# Altium project ZYNQ7010_AD9363.PrjPcb
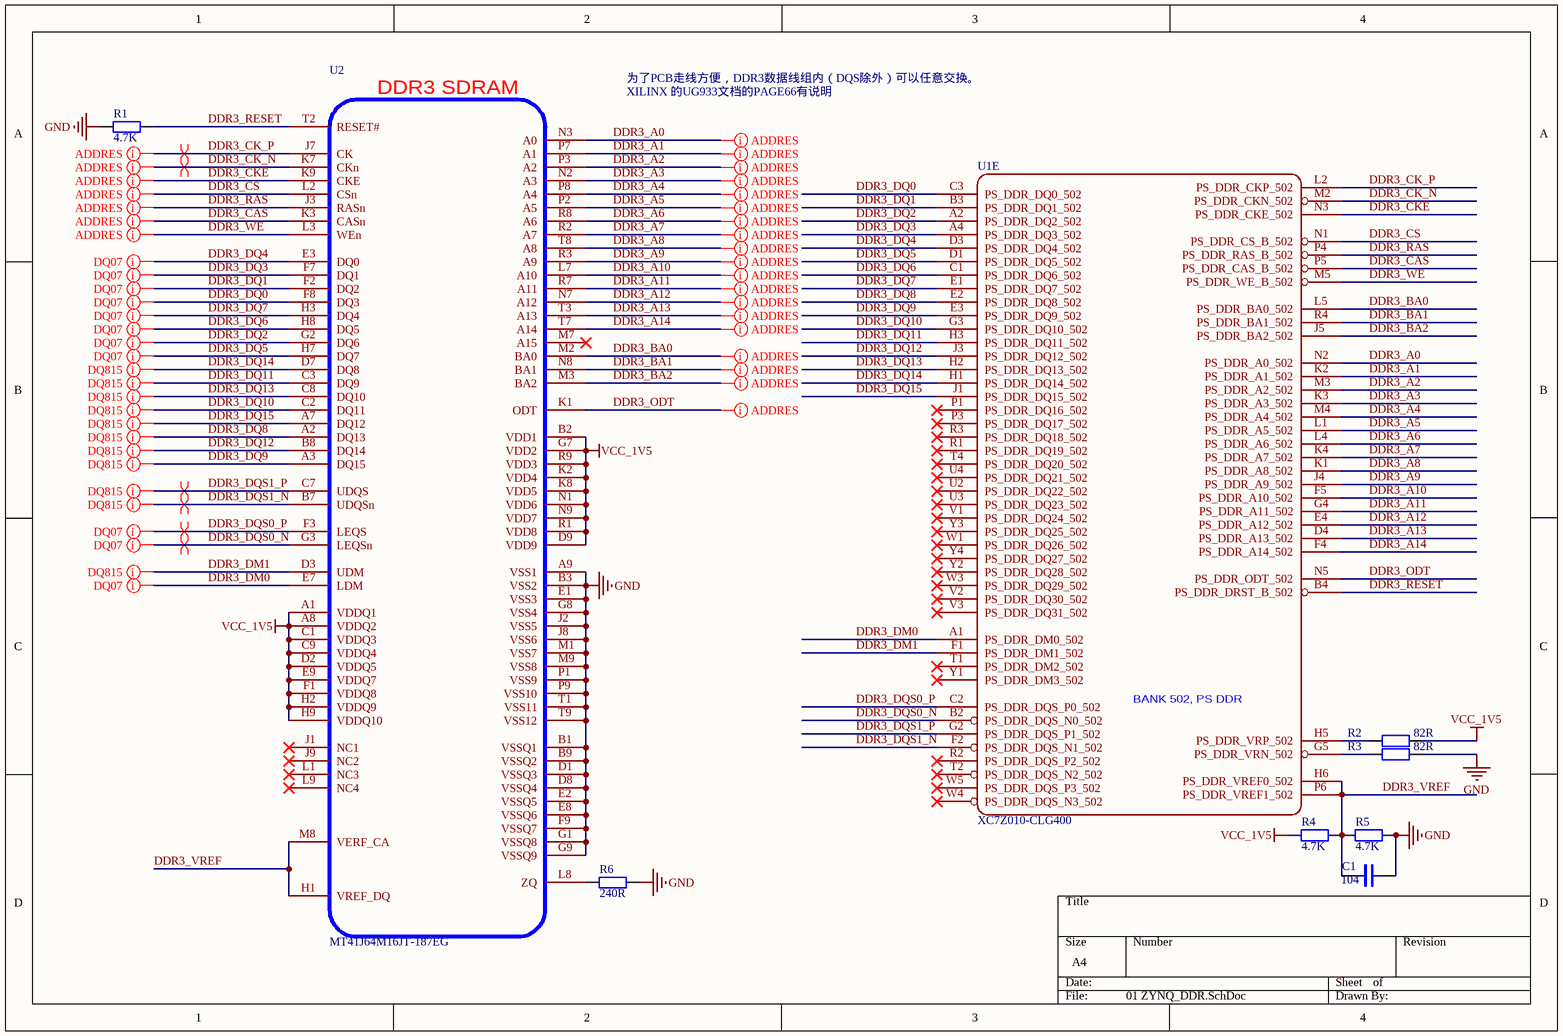
[diagram p0: 01 ZYNQ_DDR.SchDoc]
7 sheets, 283 parts. Net scope: global (net labels, ports and power ports of the same name join across sheets).
Board files: PCB1.PcbDoc, Copy of PCB1.PcbDoc, ZYNQ7010_AD9363.PcbDoc
Sheets:
  01 ZYNQ_DDR.SchDoc
  02 ZYNQ_PS-BANK500-501.SchDoc
  03 ZYNQ_PL-BANK34-35.SchDoc
  04 ZYNQ_BANK0.SchDoc
  05 POWER-SUPPLY.SchDoc
  06 ZYNQ_POWER.SchDoc
  07 AD9363.SchDoc

## Sheet 01 ZYNQ_DDR.SchDoc
size A4

### Parts
C1  104  [LC-0402_C]
R1  4.7K  [LC-0402_R]
R2  82R  [LC-0402_R]
R3  82R  [LC-0402_R]
R4  4.7K  [LC-0402_R]
R5  4.7K  [LC-0402_R]
R6  240R  [LC-0402_R]
U1  XC7Z010-CLG400  [CLG400-0.8]  (part E of 8)
U2  MT41J64M16JT-187EG  [FBGA96]

### Nets
GND: C1.2 R1.2 R3.1 R5.1 R6.2 U2.A9(VSS1) U2.B1(VSSQ1) U2.B3(VSS2) U2.B9(VSSQ2) U2.D1(VSSQ3) U2.D8(VSSQ4) U2.E1(VSS3) U2.E2(VSSQ5) U2.E8(VSSQ6) U2.F9(VSSQ7) U2.G1(VSSQ8) U2.G8(VSS4) U2.G9(VSSQ9) U2.J2(VSS5) U2.J8(VSS6) U2.M1(VSS7) U2.M9(VSS8) U2.P1(VSS9) U2.P9(VSS10) U2.T1(VSS11) U2.T9(VSS12)
VCC_1V5: R2.1 R4.2 U2.A1(VDDQ1) U2.A8(VDDQ2) U2.B2(VDD1) U2.C1(VDDQ3) U2.C9(VDDQ4) U2.D2(VDDQ5) U2.D9(VDD9) U2.E9(VDDQ7) U2.F1(VDDQ8) U2.G7(VDD2) U2.H2(VDDQ9) U2.H9(VDDQ10) U2.K2(VDD4) U2.K8(VDD5) U2.N1(VDD6) U2.N9(VDD7) U2.R1(VDD8) U2.R9(VDD3)
DDR3_A0: U1.N2(PS_DDR_A0_502) U2.N3(A0)
DDR3_A1: U1.K2(PS_DDR_A1_502) U2.P7(A1)
DDR3_A2: U1.M3(PS_DDR_A2_502) U2.P3(A2)
DDR3_A3: U1.K3(PS_DDR_A3_502) U2.N2(A3)
DDR3_A4: U1.M4(PS_DDR_A4_502) U2.P8(A4)
DDR3_A5: U1.L1(PS_DDR_A5_502) U2.P2(A5)
DDR3_A6: U1.L4(PS_DDR_A6_502) U2.R8(A6)
DDR3_A7: U1.K4(PS_DDR_A7_502) U2.R2(A7)
DDR3_A8: U1.K1(PS_DDR_A8_502) U2.T8(A8)
DDR3_A9: U1.J4(PS_DDR_A9_502) U2.R3(A9)
DDR3_A10: U1.F5(PS_DDR_A10_502) U2.L7(A10)
DDR3_A11: U1.G4(PS_DDR_A11_502) U2.R7(A11)
DDR3_A12: U1.E4(PS_DDR_A12_502) U2.N7(A12)
DDR3_A13: U1.D4(PS_DDR_A13_502) U2.T3(A13)
DDR3_A14: U1.F4(PS_DDR_A14_502) U2.T7(A14)
DDR3_BA0: U1.L5(PS_DDR_BA0_502) U2.M2(BA0)
DDR3_BA1: U1.R4(PS_DDR_BA1_502) U2.N8(BA1)
DDR3_BA2: U1.J5(PS_DDR_BA2_502) U2.M3(BA2)
DDR3_CAS: U1.P5(PS_DDR_CAS_B_502) U2.K3(CASn)
DDR3_CK_N: U1.M2(PS_DDR_CKN_502) U2.K7(CKn)
DDR3_CK_P: U1.L2(PS_DDR_CKP_502) U2.J7(CK)
DDR3_CKE: U1.N3(PS_DDR_CKE_502) U2.K9(CKE)
DDR3_CS: U1.N1(PS_DDR_CS_B_502) U2.L2(CSn)
DDR3_DM0: U1.A1(PS_DDR_DM0_502) U2.E7(LDM)
DDR3_DM1: U1.F1(PS_DDR_DM1_502) U2.D3(UDM)
DDR3_DQ0: U1.C3(PS_DDR_DQ0_502) U2.F8(DQ3)
DDR3_DQ1: U1.B3(PS_DDR_DQ1_502) U2.F2(DQ2)
DDR3_DQ2: U1.A2(PS_DDR_DQ2_502) U2.G2(DQ6)
DDR3_DQ3: U1.A4(PS_DDR_DQ3_502) U2.F7(DQ1)
DDR3_DQ4: U1.D3(PS_DDR_DQ4_502) U2.E3(DQ0)
DDR3_DQ5: U1.D1(PS_DDR_DQ5_502) U2.H7(DQ7)
DDR3_DQ6: U1.C1(PS_DDR_DQ6_502) U2.H8(DQ5)
DDR3_DQ7: U1.E1(PS_DDR_DQ7_502) U2.H3(DQ4)
DDR3_DQ8: U1.E2(PS_DDR_DQ8_502) U2.A2(DQ13)
DDR3_DQ9: U1.E3(PS_DDR_DQ9_502) U2.A3(DQ15)
DDR3_DQ10: U1.G3(PS_DDR_DQ10_502) U2.C2(DQ11)
DDR3_DQ11: U1.H3(PS_DDR_DQ11_502) U2.C3(DQ9)
DDR3_DQ12: U1.J3(PS_DDR_DQ12_502) U2.B8(DQ14)
DDR3_DQ13: U1.H2(PS_DDR_DQ13_502) U2.C8(DQ10)
DDR3_DQ14: U1.H1(PS_DDR_DQ14_502) U2.D7(DQ8)
DDR3_DQ15: U1.J1(PS_DDR_DQ15_502) U2.A7(DQ12)
DDR3_DQS0_N: U1.B2(PS_DDR_DQS_N0_502) U2.G3(LEQSn)
DDR3_DQS0_P: U1.C2(PS_DDR_DQS_P0_502) U2.F3(LEQS)
DDR3_DQS1_N: U1.F2(PS_DDR_DQS_N1_502) U2.B7(UDQSn)
DDR3_DQS1_P: U1.G2(PS_DDR_DQS_P1_502) U2.C7(UDQS)
DDR3_ODT: U1.N5(PS_DDR_ODT_502) U2.K1(ODT)
DDR3_RAS: U1.P4(PS_DDR_RAS_B_502) U2.J3(RASn)
DDR3_RESET: R1.1 U1.B4(PS_DDR_DRST_B_502) U2.T2(RESET#)
DDR3_VREF: C1.1 R4.1 R5.2 U1.H6(PS_DDR_VREF0_502) U1.P6(PS_DDR_VREF1_502) U2.H1(VREF_DQ) U2.M8(VERF_CA)
DDR3_WE: U1.M5(PS_DDR_WE_B_502) U2.L3(WEn)
NetR2_2: R2.2 U1.H5(PS_DDR_VRP_502)
NetR3_2: R3.2 U1.G5(PS_DDR_VRN_502)
NetR6_1: R6.1 U2.L8(ZQ)

Not connected (* = marked no-connect by the designer): U1 P1(PS_DDR_DQ16_502)* P3(PS_DDR_DQ17_502)* R1(PS_DDR_DQ19_502)* R2(PS_DDR_DQS_P2_502)* R3(PS_DDR_DQ18_502)* T1(PS_DDR_DM2_502)* T2(PS_DDR_DQS_N2_502)* T4(PS_DDR_DQ20_502)* U2(PS_DDR_DQ22_502)* U3(PS_DDR_DQ23_502)* U4(PS_DDR_DQ21_502)* V1(PS_DDR_DQ24_502)* V2(PS_DDR_DQ30_502)* V3(PS_DDR_DQ31_502)* W1(PS_DDR_DQ26_502)* W3(PS_DDR_DQ29_502)* W4(PS_DDR_DQS_N3_502)* W5(PS_DDR_DQS_P3_502)* Y1(PS_DDR_DM3_502)* Y2(PS_DDR_DQ28_502)* Y3(PS_DDR_DQ25_502)* Y4(PS_DDR_DQ27_502)*; U2 J1(NC1)* J9(NC2)* L1(NC3)* L9(NC4)* M7(A15)*

### Layout directives
net class ADDRES: DDR3_A0, DDR3_A1, DDR3_A2, DDR3_A3, DDR3_A4, DDR3_A5, DDR3_A6, DDR3_A7, DDR3_A8, DDR3_A9, DDR3_A10, DDR3_A11, DDR3_A12, DDR3_A13, DDR3_A14, DDR3_BA0, DDR3_BA1, DDR3_BA2, DDR3_CAS, DDR3_CK_N, DDR3_CK_P, DDR3_CKE, DDR3_CS, DDR3_ODT, DDR3_RAS, DDR3_WE
net class DQ07: DDR3_DM0, DDR3_DQ0, DDR3_DQ1, DDR3_DQ2, DDR3_DQ3, DDR3_DQ4, DDR3_DQ5, DDR3_DQ6, DDR3_DQ7, DDR3_DQS0_N, DDR3_DQS0_P
net class DQ815: DDR3_DM1, DDR3_DQ8, DDR3_DQ9, DDR3_DQ10, DDR3_DQ11, DDR3_DQ12, DDR3_DQ13, DDR3_DQ14, DDR3_DQ15, DDR3_DQS1_N, DDR3_DQS1_P
differential pair: DDR3_CK_N, DDR3_CK_P, DDR3_DQS0_N, DDR3_DQS0_P, DDR3_DQS1_N, DDR3_DQS1_P

### Notes on the sheet
- 为了PCB走线方便，DDR3数据线组内（DQS除外）可以任意交换。
- XILINX 的UG933文档的PAGE66有说明
- (in symbol DDR3) DDR3 SDRAM
- (in symbol XC7Z010-CLG400, part E) BANK 502, PS DDR

### Library data of the parts
C1 = CAP: Capacitor
R1-R6 = RES: Resistor
U2 = DDR3

## Sheet 02 ZYNQ_PS-BANK500-501.SchDoc
size A4
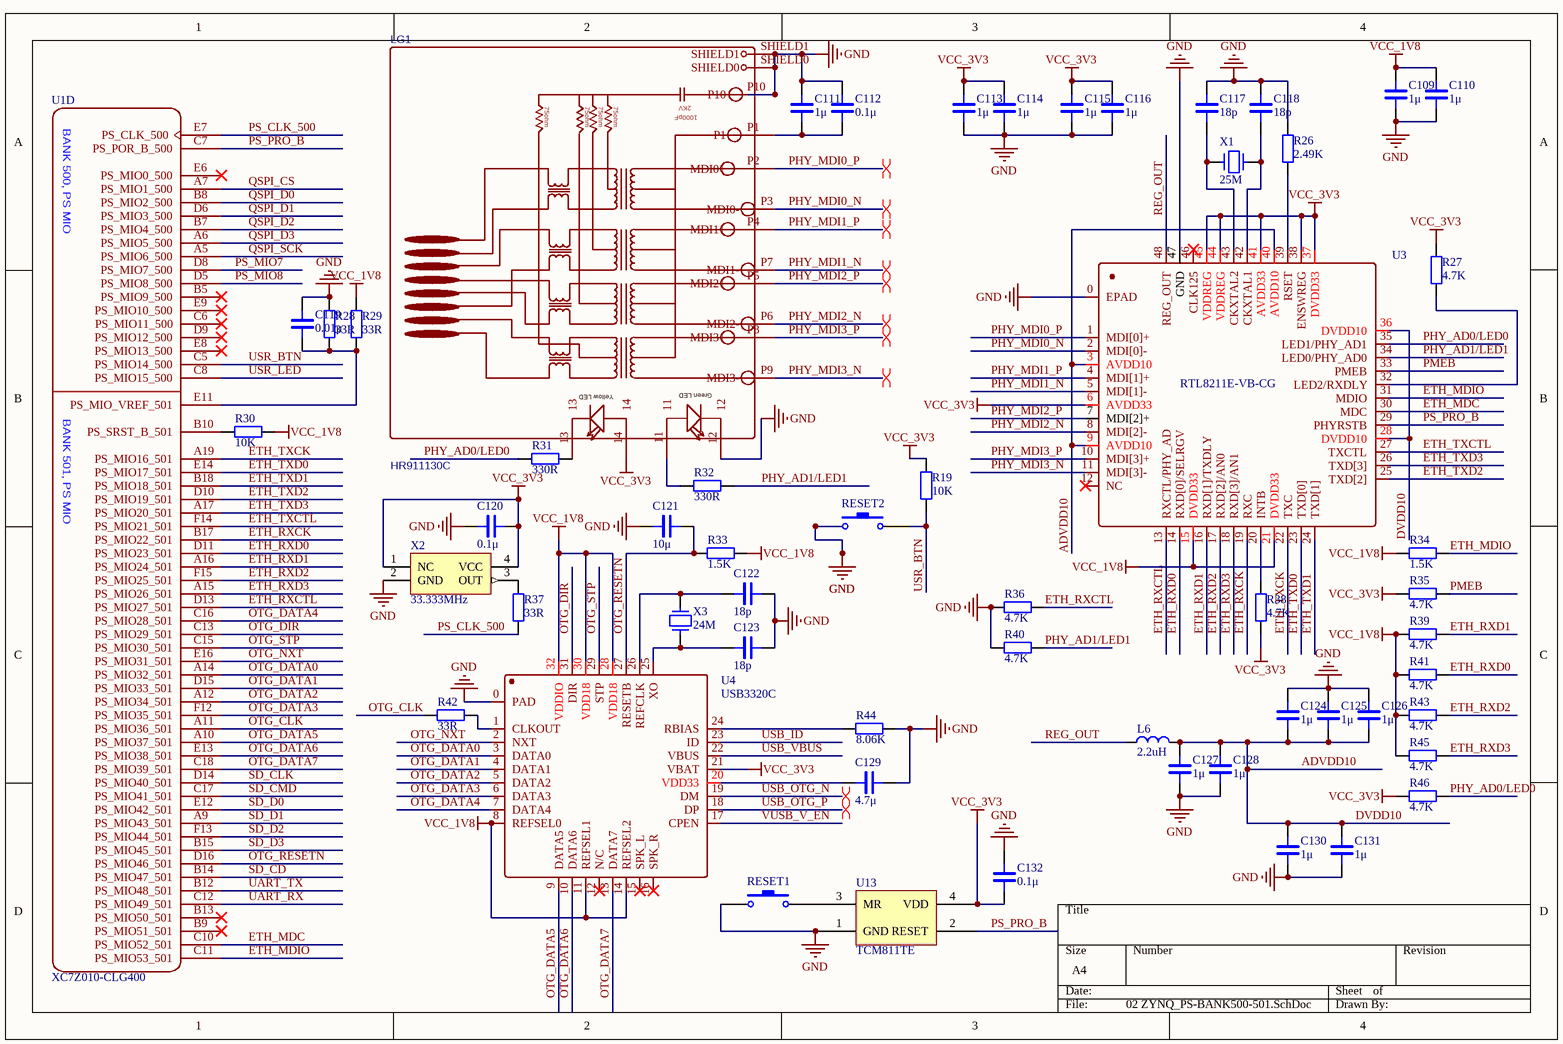
[diagram p1: 02 ZYNQ_PS-BANK500-501.SchDoc]

### Parts
C109  1μ  [LC-0402_C]
C110  1μ  [LC-0402_C]
C111  1μ  [LC-0402_C]
C112  0.1μ  [LC-0402_C]
C113  1μ  [LC-0402_C]
C114  1μ  [LC-0402_C]
C115  1μ  [LC-0402_C]
C116  1μ  [LC-0402_C]
C117  18p  [LC-0402_C]
C118  18p  [LC-0402_C]
C119  0.01μ  [LC-0402_C]
C120  0.1μ  [LC-0402_C]
C121  10μ  [LC-0402_C]
C122  18p  [LC-0402_C]
C123  18p  [LC-0402_C]
C124  1μ  [LC-0402_C]
C125  1μ  [LC-0402_C]
C126  1μ  [LC-0402_C]
C127  1μ  [LC-0402_C]
C128  1μ  [LC-0402_C]
C129  4.7μ  [LC-0402_C]
C130  1μ  [LC-0402_C]
C131  1μ  [LC-0402_C]
C132  0.1μ  [LC-0402_C]
L6  2.2uH  [L1008]
LG1  HR911130C  [HR911130C]
R19  10K  [LC-0402_R]
R26  2.49K  [LC-0402_R]
R27  4.7K  [LC-0402_R]
R28  33R  [LC-0402_R]
R29  33R  [LC-0402_R]
R30  10K  [LC-0402_R]
R31  330R  [LC-0402_R]
R32  330R  [LC-0402_R]
R33  1.5K  [LC-0402_R]
R34  1.5K  [LC-0402_R]
R35  4.7K  [LC-0402_R]
R36  4.7K  [LC-0402_R]
R37  33R  [LC-0402_R]
R38  4.7K  [LC-0402_R]
R39  4.7K  [LC-0402_R]
R40  4.7K  [LC-0402_R]
R41  4.7K  [LC-0402_R]
R42  33R  [LC-0402_R]
R43  4.7K  [LC-0402_R]
R44  8.06K  [LC-0402_R]
R45  4.7K  [LC-0402_R]
R46  4.7K  [LC-0402_R]
RESET1  SW-PB  [开关]  (value not drawn)
RESET2  SW-PB  [开关]  (value not drawn)
U1  XC7Z010-CLG400  [CLG400-0.8]  (part D of 8)
U3  RTL8211E-VB-CG  [LC-QFN-48_6x6x04P]
U4  USB3320C  [LC-QFN-32_5x5x05P]
U13  TCM811TE  [TCM811TERCTR]
X1  25M  [LC-SMD-5032_2P]
X2  33.333MHz  [OSC-SMD_4P-L3.2-W2.5-BL]
X3  24M  [LC-SMD-5032_2P]

### Nets
GND: C109.1 C110.1 C111.2 C112.2 C113.1 C114.1 C115.1 C116.1 C117.2 C118.2 C119.1 C120.2 C121.1 C122.2 C123.2 C124.2 C125.2 C126.2 C127.1 C128.1 C129.2 C130.1 C131.1 C132.2 LG1.12 LG1.P10 LG1.SHIELD0 LG1.SHIELD1 R26.2 R28.2 R36.1 R40.1 R44.2 RESET1.1 RESET2.1 U3.0(EPAD) U3.47(GND) U4.0(PAD) U13.1(GND) X2.2(GND)
VCC_1V8: C109.2 C110.2 R29.2 R30.1 R33.2 R34.1 R39.2 R41.2 R43.2 R45.2 U3.15(DVDD33) U3.21(DVDD33) U4.8(REFSEL0) U4.11(REFSEL1) U4.14(REFSEL2) U4.28(VDD18) U4.30(VDD18) U4.32(VDDIO)
VCC_3V3: C113.2 C114.2 C115.2 C116.2 C120.1 C132.1 LG1.14 R19.1 R27.2 R35.1 R38.1 R46.1 U3.6(AVDD33) U3.37(DVDD33) U3.38(ENSWREG) U3.41(AVDD33) U3.44(VDDREG) U3.45(VDDREG) U4.21(VBAT) U13.4(VDD) X2.1(NC) X2.4(VCC)
ADVDD10: C124.1 C125.1 C126.1 C127.2 C128.2 C130.2 C131.2 L6.2 U3.3(AVDD10) U3.9(AVDD10) U3.28(DVDD10) U3.36(DVDD10) U3.40(AVDD10)  [also labelled DVDD10]
ETH_MDC: U1.C10(PS_MIO52_501) U3.30(MDC)
ETH_MDIO: R34.2 U1.C11(PS_MIO53_501) U3.31(MDIO)
ETH_RXCK: U1.B17(PS_MIO22_501) U3.19(RXC)
ETH_RXCTL: R36.2 U1.D13(PS_MIO27_501) U3.13(RXCTL/PHY_AD)
ETH_RXD0: R41.1 U1.D11(PS_MIO23_501) U3.14(RXD[0]/SELRGV)
ETH_RXD1: R39.1 U1.A16(PS_MIO24_501) U3.16(RXD[1]/TXDLY)
ETH_RXD2: R43.1 U1.F15(PS_MIO25_501) U3.17(RXD[2]/AN0)
ETH_RXD3: R45.1 U1.A15(PS_MIO26_501) U3.18(RXD[3]/AN1)
ETH_TXCK: U1.A19(PS_MIO16_501) U3.22(TXC)
ETH_TXCTL: U1.F14(PS_MIO21_501) U3.27(TXCTL)
ETH_TXD0: U1.E14(PS_MIO17_501) U3.23(TXD[0])
ETH_TXD1: U1.B18(PS_MIO18_501) U3.24(TXD[1])
ETH_TXD2: U1.D10(PS_MIO19_501) U3.25(TXD[2])
ETH_TXD3: U1.A17(PS_MIO20_501) U3.26(TXD[3])
OTG_CLK: R42.1 U1.A11(PS_MIO36_501)
OTG_DATA0: U1.A14(PS_MIO32_501) U4.3(DATA0)
OTG_DATA1: U1.D15(PS_MIO33_501) U4.4(DATA1)
OTG_DATA2: U1.A12(PS_MIO34_501) U4.5(DATA2)
OTG_DATA3: U1.F12(PS_MIO35_501) U4.6(DATA3)
OTG_DATA4: U1.C16(PS_MIO28_501) U4.7(DATA4)
OTG_DATA5: U1.A10(PS_MIO37_501) U4.9(DATA5)
OTG_DATA6: U1.E13(PS_MIO38_501) U4.10(DATA6)
OTG_DATA7: U1.C18(PS_MIO39_501) U4.13(DATA7)
OTG_DIR: U1.C13(PS_MIO29_501) U4.31(DIR)
OTG_NXT: U1.E16(PS_MIO31_501) U4.2(NXT)
OTG_RESETN: C121.2 R33.1 U1.D16(PS_MIO46_501) U4.27(RESETB)
OTG_STP: U1.C15(PS_MIO30_501) U4.29(STP)
PHY_AD0/LED0: R31.1 R46.2 U3.35(LED1/PHY_AD1)
PHY_AD1/LED1: R32.1 R40.2 U3.34(LED0/PHY_AD0)
PHY_MDI0_N: LG1.P3(MDI0-) U3.2(MDI[0]-)
PHY_MDI0_P: LG1.P2(MDI0+) U3.1(MDI[0]+)
PHY_MDI1_N: LG1.P7(MDI1-) U3.5(MDI[1]-)
PHY_MDI1_P: LG1.P4(MDI1+) U3.4(MDI[1]+)
PHY_MDI2_N: LG1.P6(MDI2-) U3.8(MDI[2]-)
PHY_MDI2_P: LG1.P5(MDI2+) U3.7(MDI[2]+)
PHY_MDI3_N: LG1.P9(MDI3-) U3.11(MDI[3]-)
PHY_MDI3_P: LG1.P8(MDI3+) U3.10(MDI[3]+)
PMEB: R35.2 U3.33(PMEB)
PS_CLK_500: R37.1 U1.E7(PS_CLK_500)
PS_MIO7: U1.D8(PS_MIO7_500)
PS_MIO8: U1.D5(PS_MIO8_500)
PS_PRO_B: U1.C7(PS_POR_B_500) U3.29(PHYRSTB) U13.2(RESET)
QSPI_CS: U1.A7(PS_MIO1_500)
QSPI_D0: U1.B8(PS_MIO2_500)
QSPI_D1: U1.D6(PS_MIO3_500)
QSPI_D2: U1.B7(PS_MIO4_500)
QSPI_D3: U1.A6(PS_MIO5_500)
QSPI_SCK: U1.A5(PS_MIO6_500)
REG_OUT: L6.1 U3.48(REG_OUT)
SD_CD: U1.B14(PS_MIO47_501)
SD_CLK: U1.D14(PS_MIO40_501)
SD_CMD: U1.C17(PS_MIO41_501)
SD_D0: U1.E12(PS_MIO42_501)
SD_D1: U1.A9(PS_MIO43_501)
SD_D2: U1.F13(PS_MIO44_501)
SD_D3: U1.B15(PS_MIO45_501)
UART_RX: U1.C12(PS_MIO49_501)
UART_TX: U1.B12(PS_MIO48_501)
USB_ID: U4.23(ID)
USB_OTG_N: U4.19(DM)
USB_OTG_P: U4.18(DP)
USB_VBUS: U4.22(VBUS)
USR_BTN: R19.2 RESET2.2 U1.C5(PS_MIO14_500)
USR_LED: U1.C8(PS_MIO15_500)
VUSB_V_EN: U4.17(CPEN)
NetC111_1: C111.1 C112.1 LG1.P1
NetC117_1: C117.1 U3.43(CKXTAL2) X1.1
NetC118_1: C118.1 U3.42(CKXTAL1) X1.2
NetC119_2: C119.2 R28.1 R29.1 U1.E11(PS_MIO_VREF_501)
NetC122_1: C122.1 U4.26(REFCLK) X3.1
NetC123_1: C123.1 U4.25(XO) X3.2
NetC129_1: C129.1 U4.20(VDD33)
NetLG1_11: LG1.11 R32.2
NetLG1_13: LG1.13 R31.2
NetR26_1: R26.1 U3.39(RSET)
NetR27_1: R27.1 U3.32(LED2/RXDLY)
NetR30_2: R30.2 U1.B10(PS_SRST_B_501)
NetR37_2: R37.2 X2.3(OUT)
NetR38_2: R38.2 U3.20(INTB)
NetR42_2: R42.2 U4.1(CLKOUT)
NetR44_1: R44.1 U4.24(RBIAS)
NetRESET1_2: RESET1.2 U13.3(MR)

Not connected (* = marked no-connect by the designer): U1 B5(PS_MIO9_500)* B9(PS_MIO51_501)* B13(PS_MIO50_501)* C6(PS_MIO11_500)* D9(PS_MIO12_500)* E6(PS_MIO0_500)* E8(PS_MIO13_500)* E9(PS_MIO10_500)*; U3 12(NC)* 46(CLK125)*; U4 12(N/C)* 15(SPK_L)* 16(SPK_R)*

### Layout directives
differential pair: PHY_MDI0_N, PHY_MDI0_P, PHY_MDI1_N, PHY_MDI1_P, PHY_MDI2_N, PHY_MDI2_P, PHY_MDI3_N, PHY_MDI3_P, USB_OTG_N, USB_OTG_P

### Notes on the sheet
- (in symbol HR911130C) 2KV; 75ohm; 1000pF; J1 TX+; J2 TX-; J3 RX+; J4; J5; J6 RX-; J7; J8; Yellow LED; Green LED
- (in symbol XC7Z010-CLG400, part D) BANK 500, PS MIO; BANK 501, PS MIO

### Library data of the parts
C109-C116 C119-C121 C124-C132 = CAP_2: Capacitor
C117 C118 C122 C123 = CAP_1: Capacitor
L6 = INDUCTANCE_1: Inductance
LG1 = HR911130C: BOM_Manufacturer: HANRUN; nameAlias: Value; Contributor: LCSC; BOM_Supplier: LCSC; BOM_Manufacturer Part: HR911130C; BOM_Supplier Part: C50933; spicePre: L; spiceSymbolName: HR911130C
R19 R26-R46 = RES: Resistor
RESET1 RESET2 = SW-PB: Switch; Published: 24-Mar-1999; LatestRevisionDate: 17-Jul-2002; LatestRevisionNote: Re-released for DXP Platform.; PackageReference: SPST-2; Publisher: Altium Limited; PackageDescription: Switch; 2 Leads
X1 X3 = XTAL-2: Crystal
X2 = XTAL-4: Oscillator

## Sheet 03 ZYNQ_PL-BANK34-35.SchDoc
size A4
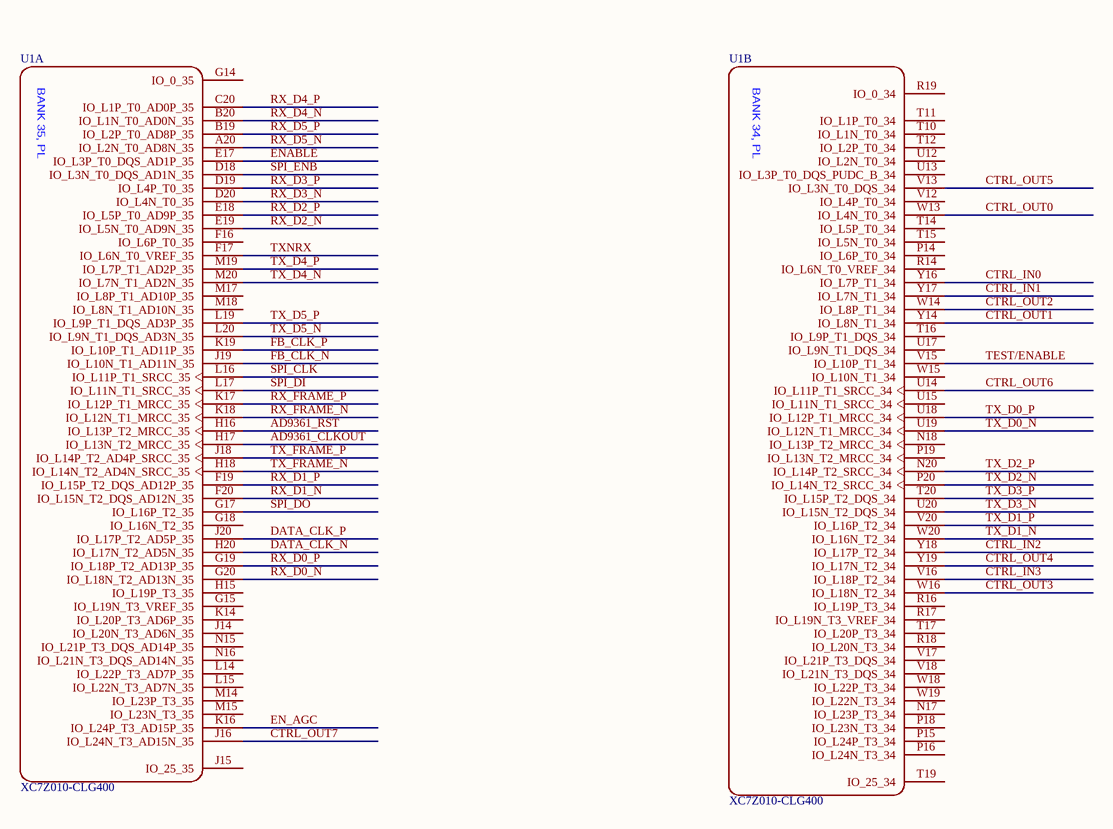
[diagram p2: 03 ZYNQ_PL-BANK34-35.SchDoc]

### Parts
U1  XC7Z010-CLG400  [CLG400-0.8]  (parts A,B of 8)

### Nets
AD9361_CLKOUT: U1.H17(IO_L13N_T2_MRCC_35)
AD9361_RST: U1.H16(IO_L13P_T2_MRCC_35)
CTRL_IN0: U1.Y16(IO_L7P_T1_34)
CTRL_IN1: U1.Y17(IO_L7N_T1_34)
CTRL_IN2: U1.Y18(IO_L17P_T2_34)
CTRL_IN3: U1.V16(IO_L18P_T2_34)
CTRL_OUT0: U1.W13(IO_L4N_T0_34)
CTRL_OUT1: U1.Y14(IO_L8N_T1_34)
CTRL_OUT2: U1.W14(IO_L8P_T1_34)
CTRL_OUT3: U1.W16(IO_L18N_T2_34)
CTRL_OUT4: U1.Y19(IO_L17N_T2_34)
CTRL_OUT5: U1.V13(IO_L3N_T0_DQS_34)
CTRL_OUT6: U1.U14(IO_L11P_T1_SRCC_34)
CTRL_OUT7: U1.J16(IO_L24N_T3_AD15N_35)
DATA_CLK_N: U1.H20(IO_L17N_T2_AD5N_35)
DATA_CLK_P: U1.J20(IO_L17P_T2_AD5P_35)
EN_AGC: U1.K16(IO_L24P_T3_AD15P_35)
ENABLE: U1.E17(IO_L3P_T0_DQS_AD1P_35)
FB_CLK_N: U1.J19(IO_L10N_T1_AD11N_35)
FB_CLK_P: U1.K19(IO_L10P_T1_AD11P_35)
RX_D0_N: U1.G20(IO_L18N_T2_AD13N_35)
RX_D0_P: U1.G19(IO_L18P_T2_AD13P_35)
RX_D1_N: U1.F20(IO_L15N_T2_DQS_AD12N_35)
RX_D1_P: U1.F19(IO_L15P_T2_DQS_AD12P_35)
RX_D2_N: U1.E19(IO_L5N_T0_AD9N_35)
RX_D2_P: U1.E18(IO_L5P_T0_AD9P_35)
RX_D3_N: U1.D20(IO_L4N_T0_35)
RX_D3_P: U1.D19(IO_L4P_T0_35)
RX_D4_N: U1.B20(IO_L1N_T0_AD0N_35)
RX_D4_P: U1.C20(IO_L1P_T0_AD0P_35)
RX_D5_N: U1.A20(IO_L2N_T0_AD8N_35)
RX_D5_P: U1.B19(IO_L2P_T0_AD8P_35)
RX_FRAME_N: U1.K18(IO_L12N_T1_MRCC_35)
RX_FRAME_P: U1.K17(IO_L12P_T1_MRCC_35)
SPI_CLK: U1.L16(IO_L11P_T1_SRCC_35)
SPI_DI: U1.L17(IO_L11N_T1_SRCC_35)
SPI_DO: U1.G17(IO_L16P_T2_35)
SPI_ENB: U1.D18(IO_L3N_T0_DQS_AD1N_35)
TEST/ENABLE: U1.V15(IO_L10P_T1_34)
TX_D0_N: U1.U19(IO_L12N_T1_MRCC_34)
TX_D0_P: U1.U18(IO_L12P_T1_MRCC_34)
TX_D1_N: U1.W20(IO_L16N_T2_34)
TX_D1_P: U1.V20(IO_L16P_T2_34)
TX_D2_N: U1.P20(IO_L14N_T2_SRCC_34)
TX_D2_P: U1.N20(IO_L14P_T2_SRCC_34)
TX_D3_N: U1.U20(IO_L15N_T2_DQS_34)
TX_D3_P: U1.T20(IO_L15P_T2_DQS_34)
TX_D4_N: U1.M20(IO_L7N_T1_AD2N_35)
TX_D4_P: U1.M19(IO_L7P_T1_AD2P_35)
TX_D5_N: U1.L20(IO_L9N_T1_DQS_AD3N_35)
TX_D5_P: U1.L19(IO_L9P_T1_DQS_AD3P_35)
TX_FRAME_N: U1.H18(IO_L14N_T2_AD4N_SRCC_35)
TX_FRAME_P: U1.J18(IO_L14P_T2_AD4P_SRCC_35)
TXNRX: U1.F17(IO_L6N_T0_VREF_35)

Not connected (* = marked no-connect by the designer): U1 F16(IO_L6P_T0_35) G14(IO_0_35) G15(IO_L19N_T3_VREF_35) G18(IO_L16N_T2_35) H15(IO_L19P_T3_35) J14(IO_L20N_T3_AD6N_35) J15(IO_25_35) K14(IO_L20P_T3_AD6P_35) L14(IO_L22P_T3_AD7P_35) L15(IO_L22N_T3_AD7N_35) M14(IO_L23P_T3_35) M15(IO_L23N_T3_35) M17(IO_L8P_T1_AD10P_35) M18(IO_L8N_T1_AD10N_35) N15(IO_L21P_T3_DQS_AD14P_35) N16(IO_L21N_T3_DQS_AD14N_35) N17(IO_L23P_T3_34) N18(IO_L13P_T2_MRCC_34) P14(IO_L6P_T0_34) P15(IO_L24P_T3_34) P16(IO_L24N_T3_34) P18(IO_L23N_T3_34) P19(IO_L13N_T2_MRCC_34) R14(IO_L6N_T0_VREF_34) R16(IO_L19P_T3_34) R17(IO_L19N_T3_VREF_34) R18(IO_L20N_T3_34) R19(IO_0_34) T10(IO_L1N_T0_34) T11(IO_L1P_T0_34) T12(IO_L2P_T0_34) T14(IO_L5P_T0_34) T15(IO_L5N_T0_34) T16(IO_L9P_T1_DQS_34) T17(IO_L20P_T3_34) T19(IO_25_34) U12(IO_L2N_T0_34) U13(IO_L3P_T0_DQS_PUDC_B_34) U15(IO_L11N_T1_SRCC_34) U17(IO_L9N_T1_DQS_34) V12(IO_L4P_T0_34) V17(IO_L21P_T3_DQS_34) V18(IO_L21N_T3_DQS_34) W15(IO_L10N_T1_34) W18(IO_L22P_T3_34) W19(IO_L22N_T3_34)

### Notes on the sheet
- (in symbol XC7Z010-CLG400, part A) BANK 35, PL
- (in symbol XC7Z010-CLG400, part B) BANK 34, PL

## Sheet 04 ZYNQ_BANK0.SchDoc
size A4
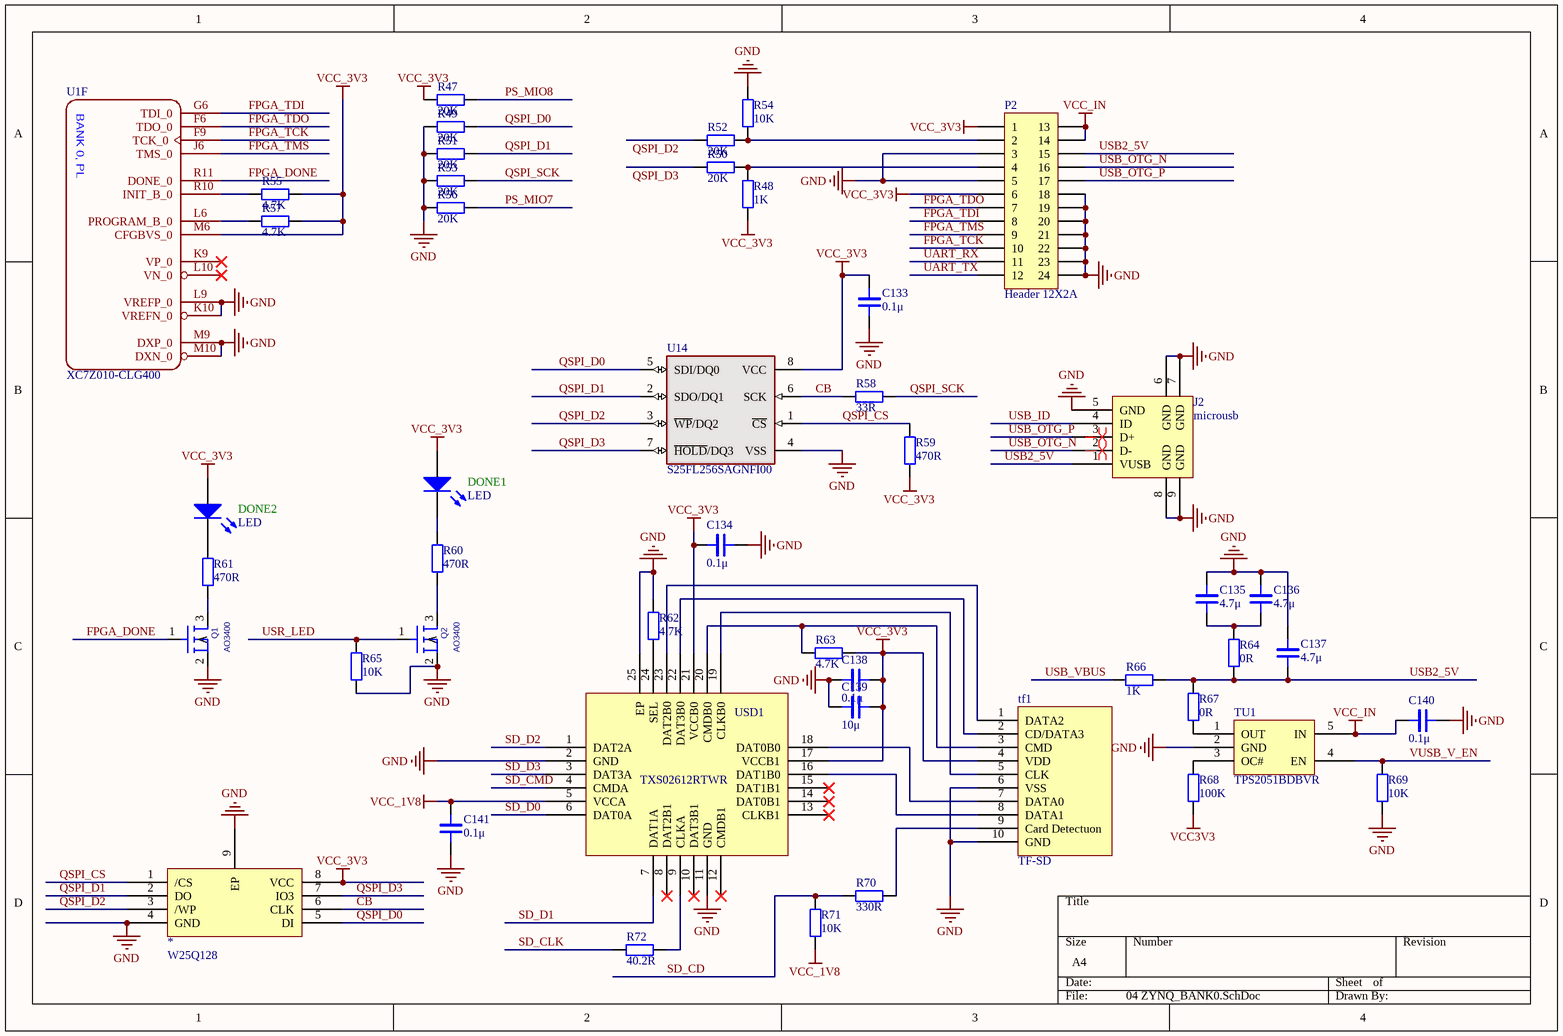
[diagram p3: 04 ZYNQ_BANK0.SchDoc]

### Parts
*  W25Q128  [W25Q256]
C133  0.1μ  [LC-0402_C]
C134  0.1μ  [LC-0402_C]
C135  4.7μ  [LC-0402_C]
C136  4.7μ  [LC-0402_C]
C137  4.7μ  [LC-0402_C]
C138  0.1μ  [LC-0402_C]
C139  10μ  [LC-0402_C]
C140  0.1μ  [LC-0402_C]
C141  0.1μ  [LC-0402_C]
DONE1  LED  [D0402]
DONE2  LED  [D0402]
J2  microusb  [micro usb]
P2  Header 12X2A  [HDR2X12_CEN]
Q1  AO3400  [NMOS]
Q2  AO3400  [NMOS]
R47  20K  [LC-0402_R]
R48  1K  [LC-0402_R]
R49  20K  [LC-0402_R]
R50  20K  [LC-0402_R]
R51  20K  [LC-0402_R]
R52  20K  [LC-0402_R]
R53  20K  [LC-0402_R]
R54  10K  [LC-0402_R]
R55  4.7K  [LC-0402_R]
R56  20K  [LC-0402_R]
R57  4.7K  [LC-0402_R]
R58  33R  [LC-0402_R]
R59  470R  [LC-0402_R]
R60  470R  [LC-0402_R]
R61  470R  [LC-0402_R]
R62  4.7K  [LC-0402_R]
R63  4.7K  [LC-0402_R]
R64  0R  [LC-0402_R]
R65  10K  [LC-0402_R]
R66  1K  [LC-0402_R]
R67  0R  [LC-0402_R]
R68  100K  [LC-0402_R]
R69  10K  [LC-0402_R]
R70  330R  [LC-0402_R]
R71  10K  [LC-0402_R]
R72  40.2R  [LC-0402_R]
tf1  TF-SD  [TF]
TU1  TPS2051BDBVR  [TPS2051BDBVR]
U1  XC7Z010-CLG400  [CLG400-0.8]  (part F of 8)
U14  S25FL256SAGNFI00  [MLP8]
USD1  TXS02612RTWR  [TXS02612RTWR]

### Nets
GND: *.4(GND) *.9(EP) C133.2 C134.2 C135.2 C136.2 C137.2 C138.2 C139.2 C140.1 C141.2 J2.5(GND) J2.6(GND) J2.7(GND) J2.8(GND) J2.9(GND) P2.3 P2.5 P2.18 P2.19 P2.20 P2.21 P2.22 P2.23 P2.24 Q1.2(S) Q2.2(S) R49.1 R51.1 R53.1 R54.2 R56.1 R62.1 R65.2 R69.2 tf1.6(VSS) tf1.10(GND) TU1.2(GND) U1.K10(VREFN_0) U1.L9(VREFP_0) U1.M9(DXP_0) U1.M10(DXN_0) U14.4(VSS) USD1.2(GND) USD1.11(GND) USD1.25(EP)
VCC3V3: R68.2
VCC_1V8: C141.1 R71.2 USD1.5(VCCA)
VCC_3V3: *.8(VCC) C133.1 C134.1 C138.1 C139.1 DONE1.1(A) DONE2.1(A) P2.1 P2.6 R47.1 R48.1 R55.1 R57.1 R59.2 R63.1 tf1.4(VDD) U1.M6(CFGBVS_0) U14.8(VCC) USD1.17(VCCB1) USD1.21(VCCB0)
VCC_IN: C140.2 P2.13 P2.14 TU1.5(IN)
CB: *.6(CLK) R58.1 U14.6(SCK)
FPGA_DONE: Q1.1(G) U1.R11(DONE_0)
FPGA_TCK: P2.10 U1.F9(TCK_0)
FPGA_TDI: P2.8 U1.G6(TDI_0)
FPGA_TDO: P2.7 U1.F6(TDO_0)
FPGA_TMS: P2.9 U1.J6(TMS_0)
PS_MIO7: R56.2
PS_MIO8: R47.2
QSPI_CS: *.1(/CS) R59.1 U14.1(~{CS})
QSPI_D0: *.5(DI) R49.2 U14.5(SDI/DQ0)
QSPI_D1: *.2(DO) R51.2 U14.2(SDO/DQ1)
QSPI_D2: *.3(/WP) R52.2 U14.3(~{WP}/DQ2)
QSPI_D3: *.7(IO3) R50.2 U14.7(~{HOLD}/DQ3)
QSPI_SCK: R53.2 R58.2
SD_CD: R70.2 R71.1
SD_CLK: R72.2
SD_CMD: USD1.4(CMDA)
SD_D0: USD1.6(DAT0A)
SD_D1: USD1.7(DAT1A)
SD_D2: USD1.1(DAT2A)
SD_D3: USD1.3(DAT3A)
UART_RX: P2.11
UART_TX: P2.12
USB2_5V: C137.1 J2.1(VUSB) P2.15 R64.2 R66.1 R67.1
USB_ID: J2.4(ID)
USB_OTG_N: J2.2(D-) P2.16
USB_OTG_P: J2.3(D+) P2.17
USB_VBUS: R66.2
USR_LED: Q2.1(G) R65.1
VUSB_V_EN: R69.1 TU1.4(EN)
NetC135_1: C135.1 C136.1 R64.1
NetDONE1_2: DONE1.2(K) R60.2
NetDONE2_2: DONE2.2(K) R61.2
NetP2_2: P2.2 R52.1 R54.1
NetP2_4: P2.4 R48.2 R50.1
NetQ1_3: Q1.3(D) R61.1
NetQ2_3: Q2.3(D) R60.1
NetR55_2: R55.2 U1.R10(INIT_B_0)
NetR57_2: R57.2 U1.L6(PROGRAM_B_0)
NetR62_2: R62.2 USD1.24(SEL)
NetR63_2: R63.2 tf1.3(CMD) USD1.20(CMDB0)
NetR67_2: R67.2 TU1.1(OUT)
NetR68_1: R68.1 TU1.3(OC#)
NetR70_1: R70.1 tf1.9(Card_Detectuon)
NetR72_1: R72.1 USD1.9(CLKA)
Nettf1_1: tf1.1(DATA2) USD1.23(DAT2B0)
Nettf1_2: tf1.2(CD/DATA3) USD1.22(DAT3B0)
Nettf1_5: tf1.5(CLK) USD1.19(CLKB0)
Nettf1_7: tf1.7(DATA0) USD1.18(DAT0B0)
Nettf1_8: tf1.8(DATA1) USD1.16(DAT1B0)

Not connected (* = marked no-connect by the designer): U1 K9(VP_0)* L10(VN_0)*; USD1 8(DAT2B1)* 10(DAT3B1)* 12(CMDB1)* 13(CLKB1)* 14(DAT0B1)* 15(DAT1B1)*

### Layout directives
differential pair: (no net found under the mark)

### Notes on the sheet
- (in symbol XC7Z010-CLG400, part F) BANK 0, PL

### Library data of the parts
C133-C141 = CAP_2: Capacitor
DONE1 DONE2 = LED0: Typical INFRARED GaAs LED; Published: 8-Jun-2000; LatestRevisionDate: 08-Jul-2005; LatestRevisionNote: Mech Layer 1 removed.; PackageReference: LED-0; Publisher: Altium Limited; PackageDescription: LED; 2 Leads
P2 = Header 12X2A: Header, 12-Pin, Dual row; LatestRevisionDate: 17-Jul-2002; LatestRevisionNote: Re-released for DXP Platform.; Publisher: Altium Limited
Q1 Q2 = AO3400: PSpiceTemplate: X^@REFDES %d %g %s @MODEL
R47-R72 = RES: Resistor
U14 = N25Q12-F8: Serial Flash Memory, 16Mbit, Low Voltage, 50MHz SPI Bus Interface; Manufacturer: Spansion; DPN: *
tf1 = TF-SD: Parameter 1: *

## Sheet 05 POWER-SUPPLY.SchDoc
size A4
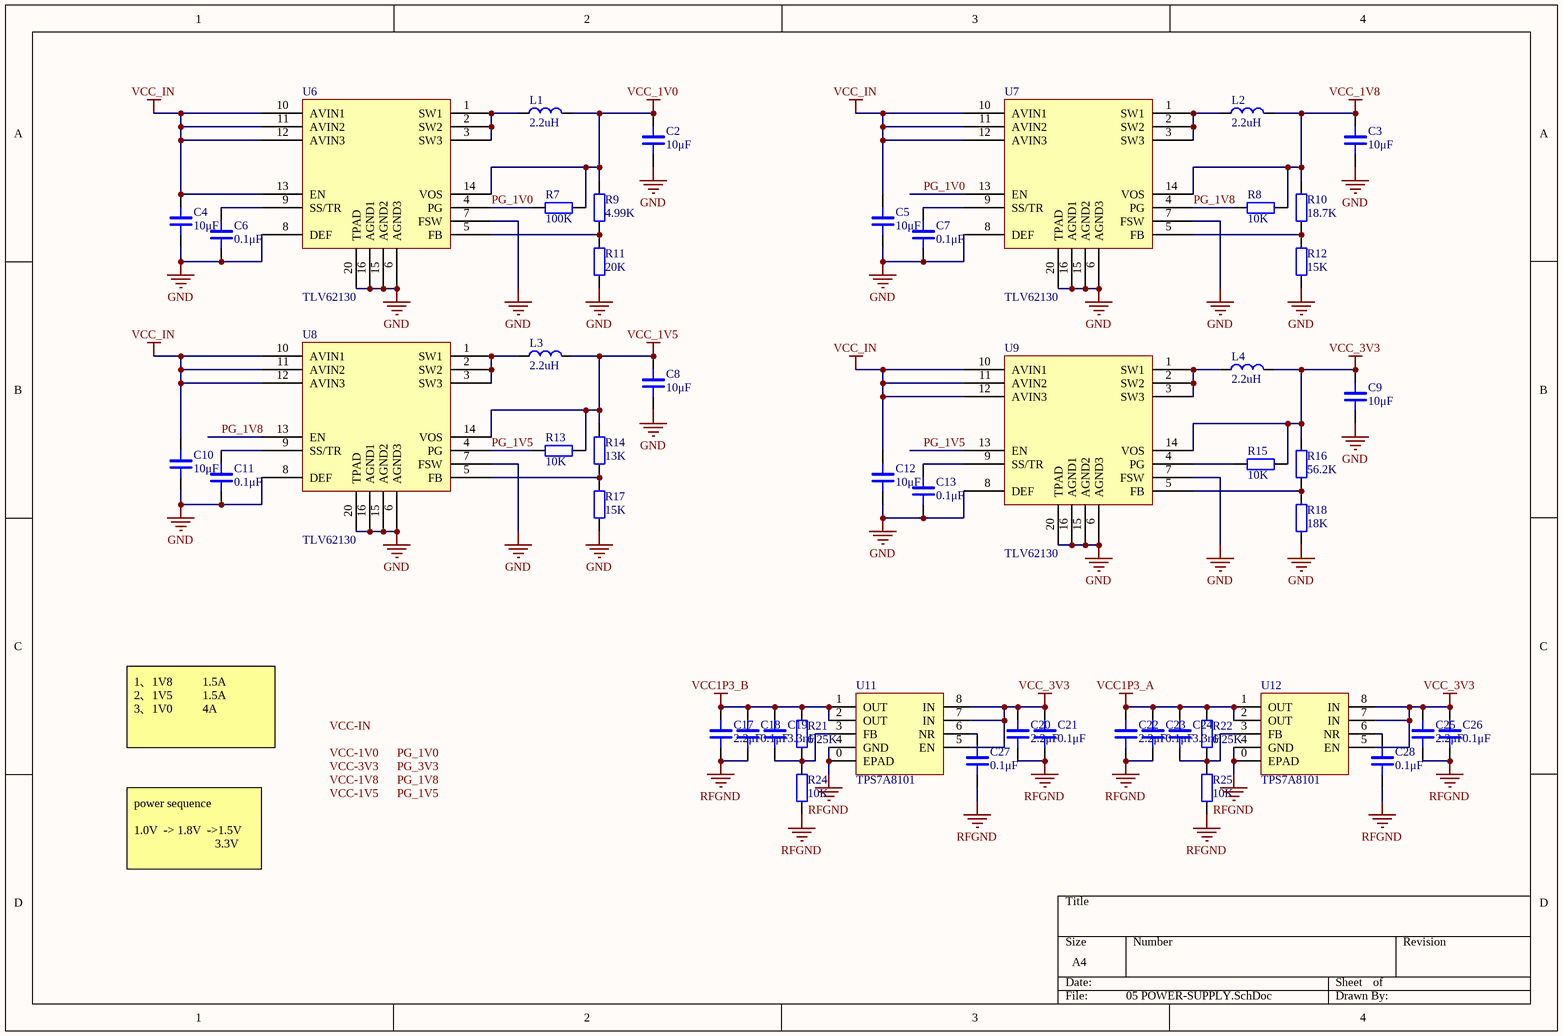
[diagram p4: 05 POWER-SUPPLY.SchDoc]

### Parts
C2  10μF  [LC-0805_C]
C3  10μF  [LC-0805_C]
C4  10μF  [LC-0805_C]
C5  10μF  [LC-0805_C]
C6  0.1μF  [LC-0402_C]
C7  0.1μF  [LC-0402_C]
C8  10μF  [LC-0805_C]
C9  10μF  [LC-0805_C]
C10  10μF  [LC-0805_C]
C11  0.1μF  [LC-0402_C]
C12  10μF  [LC-0805_C]
C13  0.1μF  [LC-0402_C]
C17  2.2μF  [LC-0805_C]
C18  0.1μF  [LC-0402_C]
C19  3.3nF  [LC-0402_C]
C20  2.2μF  [LC-0402_C]
C21  0.1μF  [LC-0805_C]
C22  2.2μF  [LC-0805_C]
C23  0.1μF  [LC-0402_C]
C24  3.3nF  [LC-0402_C]
C25  2.2μF  [LC-0402_C]
C26  0.1μF  [LC-0805_C]
C27  0.1μF  [LC-0402_C]
C28  0.1μF  [LC-0402_C]
L1  2.2uH  [L1008]
L2  2.2uH  [L1008]
L3  2.2uH  [L1008]
L4  2.2uH  [L1008]
R7  100K  [LC-0402_R]
R8  10K  [LC-0402_R]
R9  4.99K  [LC-0402_R]
R10  18.7K  [LC-0402_R]
R11  20K  [LC-0402_R]
R12  15K  [LC-0402_R]
R13  10K  [LC-0402_R]
R14  13K  [LC-0402_R]
R15  10K  [LC-0402_R]
R16  56.2K  [LC-0402_R]
R17  15K  [LC-0402_R]
R18  18K  [LC-0402_R]
R21  6.25K  [LC-0402_R]
R22  6.25K  [LC-0402_R]
R24  10K  [LC-0402_R]
R25  10K  [LC-0402_R]
U6  TLV62130  [TLV62130RGT]
U7  TLV62130  [TLV62130RGT]
U8  TLV62130  [TLV62130RGT]
U9  TLV62130  [TLV62130RGT]
U11  TPS7A8101  [TPS7A8101]
U12  TPS7A8101  [TPS7A8101]

### Nets
GND: C2.1 C3.1 C4.1 C5.1 C6.1 C7.1 C8.1 C9.1 C10.1 C11.1 C12.1 C13.1 R11.2 R12.2 R17.2 R18.2 U6.6(AGND3) U6.7(FSW) U6.8(DEF) U6.15(AGND2) U6.16(AGND1) U6.20(TPAD) U7.6(AGND3) U7.7(FSW) U7.8(DEF) U7.15(AGND2) U7.16(AGND1) U7.20(TPAD) U8.6(AGND3) U8.7(FSW) U8.8(DEF) U8.15(AGND2) U8.16(AGND1) U8.20(TPAD) U9.6(AGND3) U9.7(FSW) U9.8(DEF) U9.15(AGND2) U9.16(AGND1) U9.20(TPAD)
RFGND: C17.1 C18.1 C20.1 C21.1 C22.1 C23.1 C25.1 C26.1 C27.1 C28.1 R24.2 R25.2 U11.0(EPAD) U11.4(GND) U12.0(EPAD) U12.4(GND)
VCC1P3_A: C22.2 C23.2 C24.2 R22.1 U12.1(OUT) U12.2(OUT)  [project net VDD_DIG]
VCC1P3_B: C17.2 C18.2 C19.2 R21.1 U11.1(OUT) U11.2(OUT)  [project net VDDA_RX_LO]
VCC_1V0: C2.2 L1.2 R7.1 R9.1 U6.14(VOS)
VCC_1V5: C8.2 L3.2 R13.1 R14.1 U8.14(VOS)
VCC_1V8: C3.2 L2.2 R8.1 R10.1 U7.14(VOS)
VCC_3V3: C9.2 C20.2 C21.2 C25.2 C26.2 L4.2 R15.1 R16.1 U9.14(VOS) U11.5(EN) U11.7(IN) U11.8(IN) U12.5(EN) U12.7(IN) U12.8(IN)
VCC_IN: C4.2 C5.2 C10.2 C12.2 U6.10(AVIN1) U6.11(AVIN2) U6.12(AVIN3) U6.13(EN) U7.10(AVIN1) U7.11(AVIN2) U7.12(AVIN3) U8.10(AVIN1) U8.11(AVIN2) U8.12(AVIN3) U9.10(AVIN1) U9.11(AVIN2) U9.12(AVIN3)
PG_1V0: R7.2 U6.4(PG) U7.13(EN)
PG_1V5: R13.2 U8.4(PG) U9.13(EN)
PG_1V8: R8.2 U7.4(PG) U8.13(EN)
NetC6_2: C6.2 U6.9(SS/TR)
NetC7_2: C7.2 U7.9(SS/TR)
NetC11_2: C11.2 U8.9(SS/TR)
NetC13_2: C13.2 U9.9(SS/TR)
NetC19_1: C19.1 R21.2 R24.1 U11.3(FB)
NetC24_1: C24.1 R22.2 R25.1 U12.3(FB)
NetC27_2: C27.2 U11.6(NR)
NetC28_2: C28.2 U12.6(NR)
NetL1_1: L1.1 U6.1(SW1) U6.2(SW2) U6.3(SW3)
NetL2_1: L2.1 U7.1(SW1) U7.2(SW2) U7.3(SW3)
NetL3_1: L3.1 U8.1(SW1) U8.2(SW2) U8.3(SW3)
NetL4_1: L4.1 U9.1(SW1) U9.2(SW2) U9.3(SW3)
NetR9_2: R9.2 R11.1 U6.5(FB)
NetR10_2: R10.2 R12.1 U7.5(FB)
NetR14_2: R14.2 R17.1 U8.5(FB)
NetR15_2: R15.2 U9.4(PG)
NetR16_2: R16.2 R18.1 U9.5(FB)

### Notes on the sheet
- 1、1V8          1.5A
  2、1V5          1.5A
  3、1V0          4A
- 1.3V
- power sequence
  1.0V  -> 1.8V  ->1.5V
  3.3V
- Labels drawn without touching a wire or pin: PG_1V0, PG_1V5, PG_1V8, PG_3V3, VCC-1V0, VCC-1V5, VCC-1V8, VCC-3V3, VCC-IN

### Library data of the parts
C2-C13 C17-C28 = CAP_3: Capacitor
L1-L4 = INDUCTANCE_1: Inductance
R7-R18 R21 R22 R24 R25 = RES: Resistor

## Sheet 06 ZYNQ_POWER.SchDoc
size A4
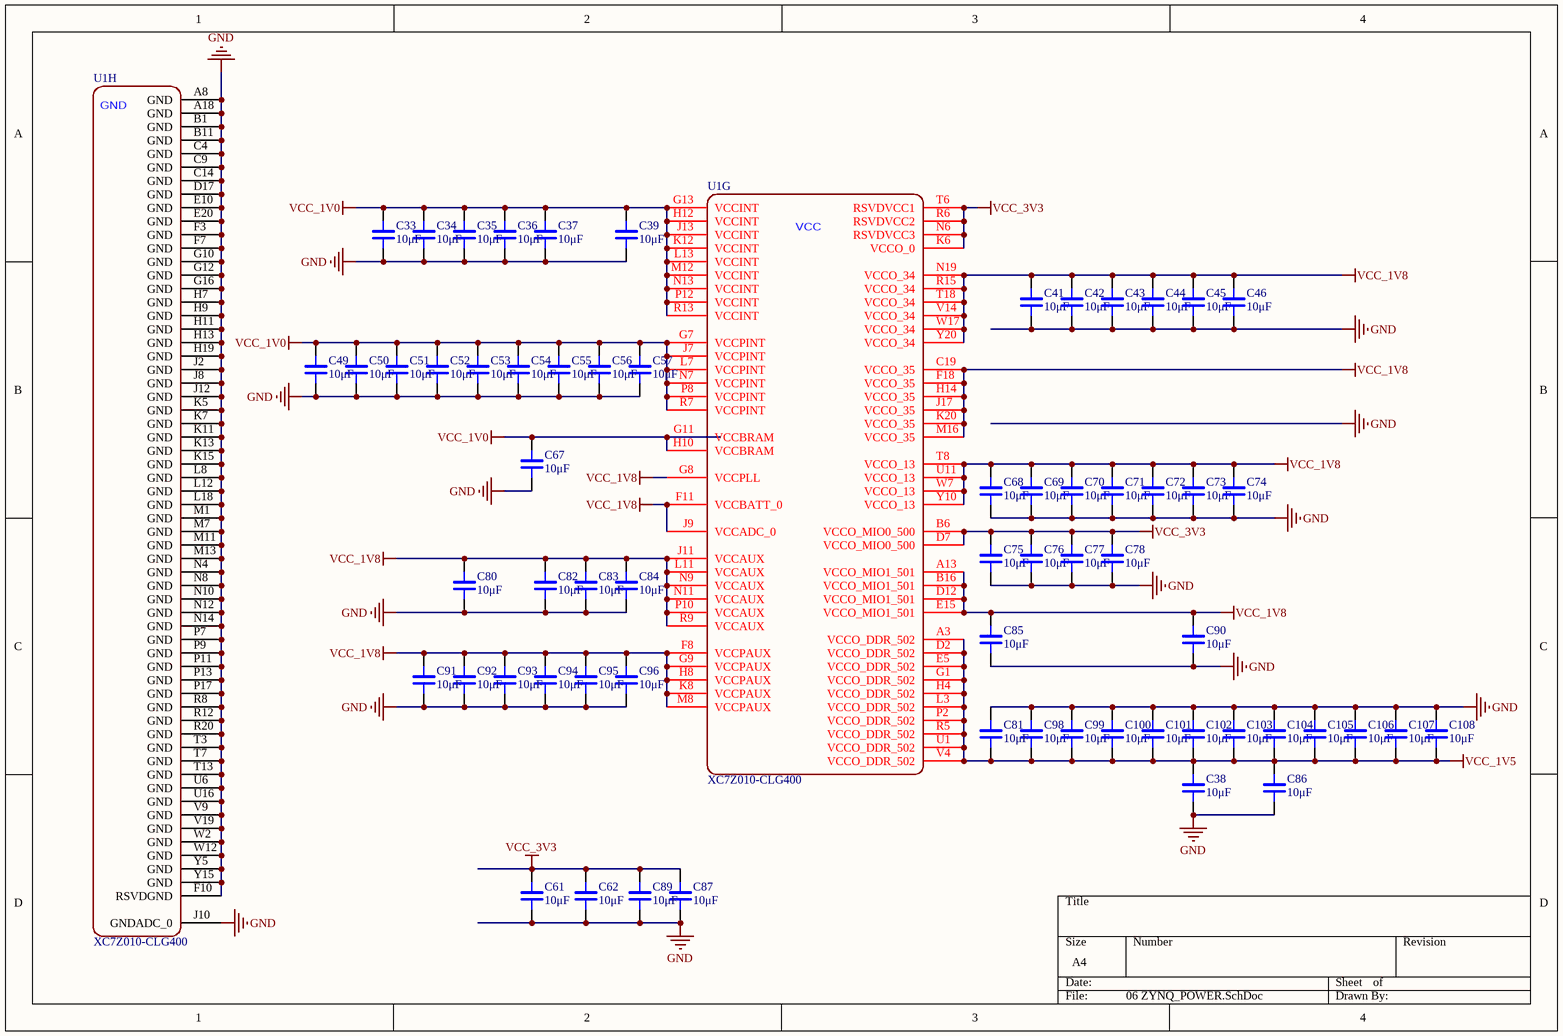
[diagram p5: 06 ZYNQ_POWER.SchDoc]

### Parts
C33  10μF  [LC-0402_C]
C34  10μF  [LC-0402_C]
C35  10μF  [LC-0402_C]
C36  10μF  [LC-0402_C]
C37  10μF  [LC-0402_C]
C38  10μF  [LC-0402_C]
C39  10μF  [LC-0402_C]
C41  10μF  [LC-0402_C]
C42  10μF  [LC-0402_C]
C43  10μF  [LC-0402_C]
C44  10μF  [LC-0402_C]
C45  10μF  [LC-0402_C]
C46  10μF  [LC-0402_C]
C49  10μF  [LC-0402_C]
C50  10μF  [LC-0402_C]
C51  10μF  [LC-0402_C]
C52  10μF  [LC-0402_C]
C53  10μF  [LC-0402_C]
C54  10μF  [LC-0402_C]
C55  10μF  [LC-0402_C]
C56  10μF  [LC-0402_C]
C57  10μF  [LC-0402_C]
C61  10μF  [LC-0402_C]
C62  10μF  [LC-0402_C]
C67  10μF  [LC-0402_C]
C68  10μF  [LC-0402_C]
C69  10μF  [LC-0402_C]
C70  10μF  [LC-0402_C]
C71  10μF  [LC-0402_C]
C72  10μF  [LC-0402_C]
C73  10μF  [LC-0402_C]
C74  10μF  [LC-0402_C]
C75  10μF  [LC-0402_C]
C76  10μF  [LC-0402_C]
C77  10μF  [LC-0402_C]
C78  10μF  [LC-0402_C]
C80  10μF  [LC-0402_C]
C81  10μF  [LC-0402_C]
C82  10μF  [LC-0402_C]
C83  10μF  [LC-0402_C]
C84  10μF  [LC-0402_C]
C85  10μF  [LC-0402_C]
C86  10μF  [LC-0402_C]
C87  10μF  [LC-0402_C]
C89  10μF  [LC-0402_C]
C90  10μF  [LC-0402_C]
C91  10μF  [LC-0402_C]
C92  10μF  [LC-0402_C]
C93  10μF  [LC-0402_C]
C94  10μF  [LC-0402_C]
C95  10μF  [LC-0402_C]
C96  10μF  [LC-0402_C]
C98  10μF  [LC-0402_C]
C99  10μF  [LC-0402_C]
C100  10μF  [LC-0402_C]
C101  10μF  [LC-0402_C]
C102  10μF  [LC-0402_C]
C103  10μF  [LC-0402_C]
C104  10μF  [LC-0402_C]
C105  10μF  [LC-0402_C]
C106  10μF  [LC-0402_C]
C107  10μF  [LC-0402_C]
C108  10μF  [LC-0402_C]
U1  XC7Z010-CLG400  [CLG400-0.8]  (parts G,H of 8)

### Nets
GND: C33.1 C34.1 C35.1 C36.1 C37.1 C38.1 C39.1 C41.1 C42.1 C43.1 C44.1 C45.1 C46.1 C49.1 C50.1 C51.1 C52.1 C53.1 C54.1 C55.1 C56.1 C57.1 C61.1 C62.1 C67.1 C68.1 C69.1 C70.1 C71.1 C72.1 C73.1 C74.1 C75.1 C76.1 C77.1 C78.1 C80.1 C81.2 C82.1 C83.1 C84.1 C85.1 C86.1 C87.1 C89.1 C90.1 C91.1 C92.1 C93.1 C94.1 C95.1 C96.1 C98.2 C99.2 C100.2 C101.2 C102.2 C103.2 C104.2 C105.2 C106.2 C107.2 C108.2 U1.A8(GND) U1.A18(GND) U1.B1(GND) U1.B11(GND) U1.C4(GND) U1.C9(GND) U1.C14(GND) U1.D17(GND) U1.E10(GND) U1.E20(GND) U1.F3(GND) U1.F7(GND) U1.F10(RSVDGND) U1.G10(GND) U1.G12(GND) U1.G16(GND) U1.H7(GND) U1.H9(GND) U1.H11(GND) U1.H13(GND) U1.H19(GND) U1.J2(GND) U1.J8(GND) U1.J10(GNDADC_0) U1.J12(GND) U1.K5(GND) U1.K7(GND) U1.K11(GND) U1.K13(GND) U1.K15(GND) U1.L8(GND) U1.L12(GND) U1.L18(GND) U1.M1(GND) U1.M7(GND) U1.M11(GND) U1.M13(GND) U1.N4(GND) U1.N8(GND) U1.N10(GND) U1.N12(GND) U1.N14(GND) U1.P7(GND) U1.P9(GND) U1.P11(GND) U1.P13(GND) U1.P17(GND) U1.R8(GND) U1.R12(GND) U1.R20(GND) U1.T3(GND) U1.T7(GND) U1.T13(GND) U1.U6(GND) U1.U16(GND) U1.V9(GND) U1.V19(GND) U1.W2(GND) U1.W12(GND) U1.Y5(GND) U1.Y15(GND)
VCC_1V0: C33.2 C34.2 C35.2 C36.2 C37.2 C39.2 C49.2 C50.2 C51.2 C52.2 C53.2 C54.2 C55.2 C56.2 C57.2 C67.2 U1.G7(VCCPINT) U1.G11(VCCBRAM) U1.G13(VCCINT) U1.H10(VCCBRAM) U1.H12(VCCINT) U1.J7(VCCPINT) U1.J13(VCCINT) U1.K12(VCCINT) U1.L7(VCCPINT) U1.L13(VCCINT) U1.M12(VCCINT) U1.N7(VCCPINT) U1.N13(VCCINT) U1.P8(VCCPINT) U1.P12(VCCINT) U1.R7(VCCPINT) U1.R13(VCCINT)
VCC_1V5: C38.2 C81.1 C86.2 C98.1 C99.1 C100.1 C101.1 C102.1 C103.1 C104.1 C105.1 C106.1 C107.1 C108.1 U1.A3(VCCO_DDR_502) U1.D2(VCCO_DDR_502) U1.E5(VCCO_DDR_502) U1.G1(VCCO_DDR_502) U1.H4(VCCO_DDR_502) U1.L3(VCCO_DDR_502) U1.P2(VCCO_DDR_502) U1.R5(VCCO_DDR_502) U1.U1(VCCO_DDR_502) U1.V4(VCCO_DDR_502)
VCC_1V8: C41.2 C42.2 C43.2 C44.2 C45.2 C46.2 C68.2 C69.2 C70.2 C71.2 C72.2 C73.2 C74.2 C80.2 C82.2 C83.2 C84.2 C85.2 C90.2 C91.2 C92.2 C93.2 C94.2 C95.2 C96.2 U1.A13(VCCO_MIO1_501) U1.B16(VCCO_MIO1_501) U1.C19(VCCO_35) U1.D12(VCCO_MIO1_501) U1.E15(VCCO_MIO1_501) U1.F8(VCCPAUX) U1.F11(VCCBATT_0) U1.F18(VCCO_35) U1.G8(VCCPLL) U1.G9(VCCPAUX) U1.H8(VCCPAUX) U1.H14(VCCO_35) U1.J9(VCCADC_0) U1.J11(VCCAUX) U1.J17(VCCO_35) U1.K8(VCCPAUX) U1.K20(VCCO_35) U1.L11(VCCAUX) U1.M8(VCCPAUX) U1.M16(VCCO_35) U1.N9(VCCAUX) U1.N11(VCCAUX) U1.N19(VCCO_34) U1.P10(VCCAUX) U1.R9(VCCAUX) U1.R15(VCCO_34) U1.T8(VCCO_13) U1.T18(VCCO_34) U1.U11(VCCO_13) U1.V14(VCCO_34) U1.W7(VCCO_13) U1.W17(VCCO_34) U1.Y10(VCCO_13) U1.Y20(VCCO_34)
VCC_3V3: C61.2 C62.2 C75.2 C76.2 C77.2 C78.2 C87.2 C89.2 U1.B6(VCCO_MIO0_500) U1.D7(VCCO_MIO0_500) U1.K6(VCCO_0) U1.N6(RSVDVCC3) U1.R6(RSVDVCC2) U1.T6(RSVDVCC1)

### Notes on the sheet
- (in symbol XC7Z010-CLG400, part G) VCC

### Library data of the parts
C33-C39 C41-C46 C49-C57 C61 C62 C67-C78 C80-C87 C89-C96 C98-C108 = CAP_3: Capacitor

## Sheet 07 AD9363.SchDoc
size A3
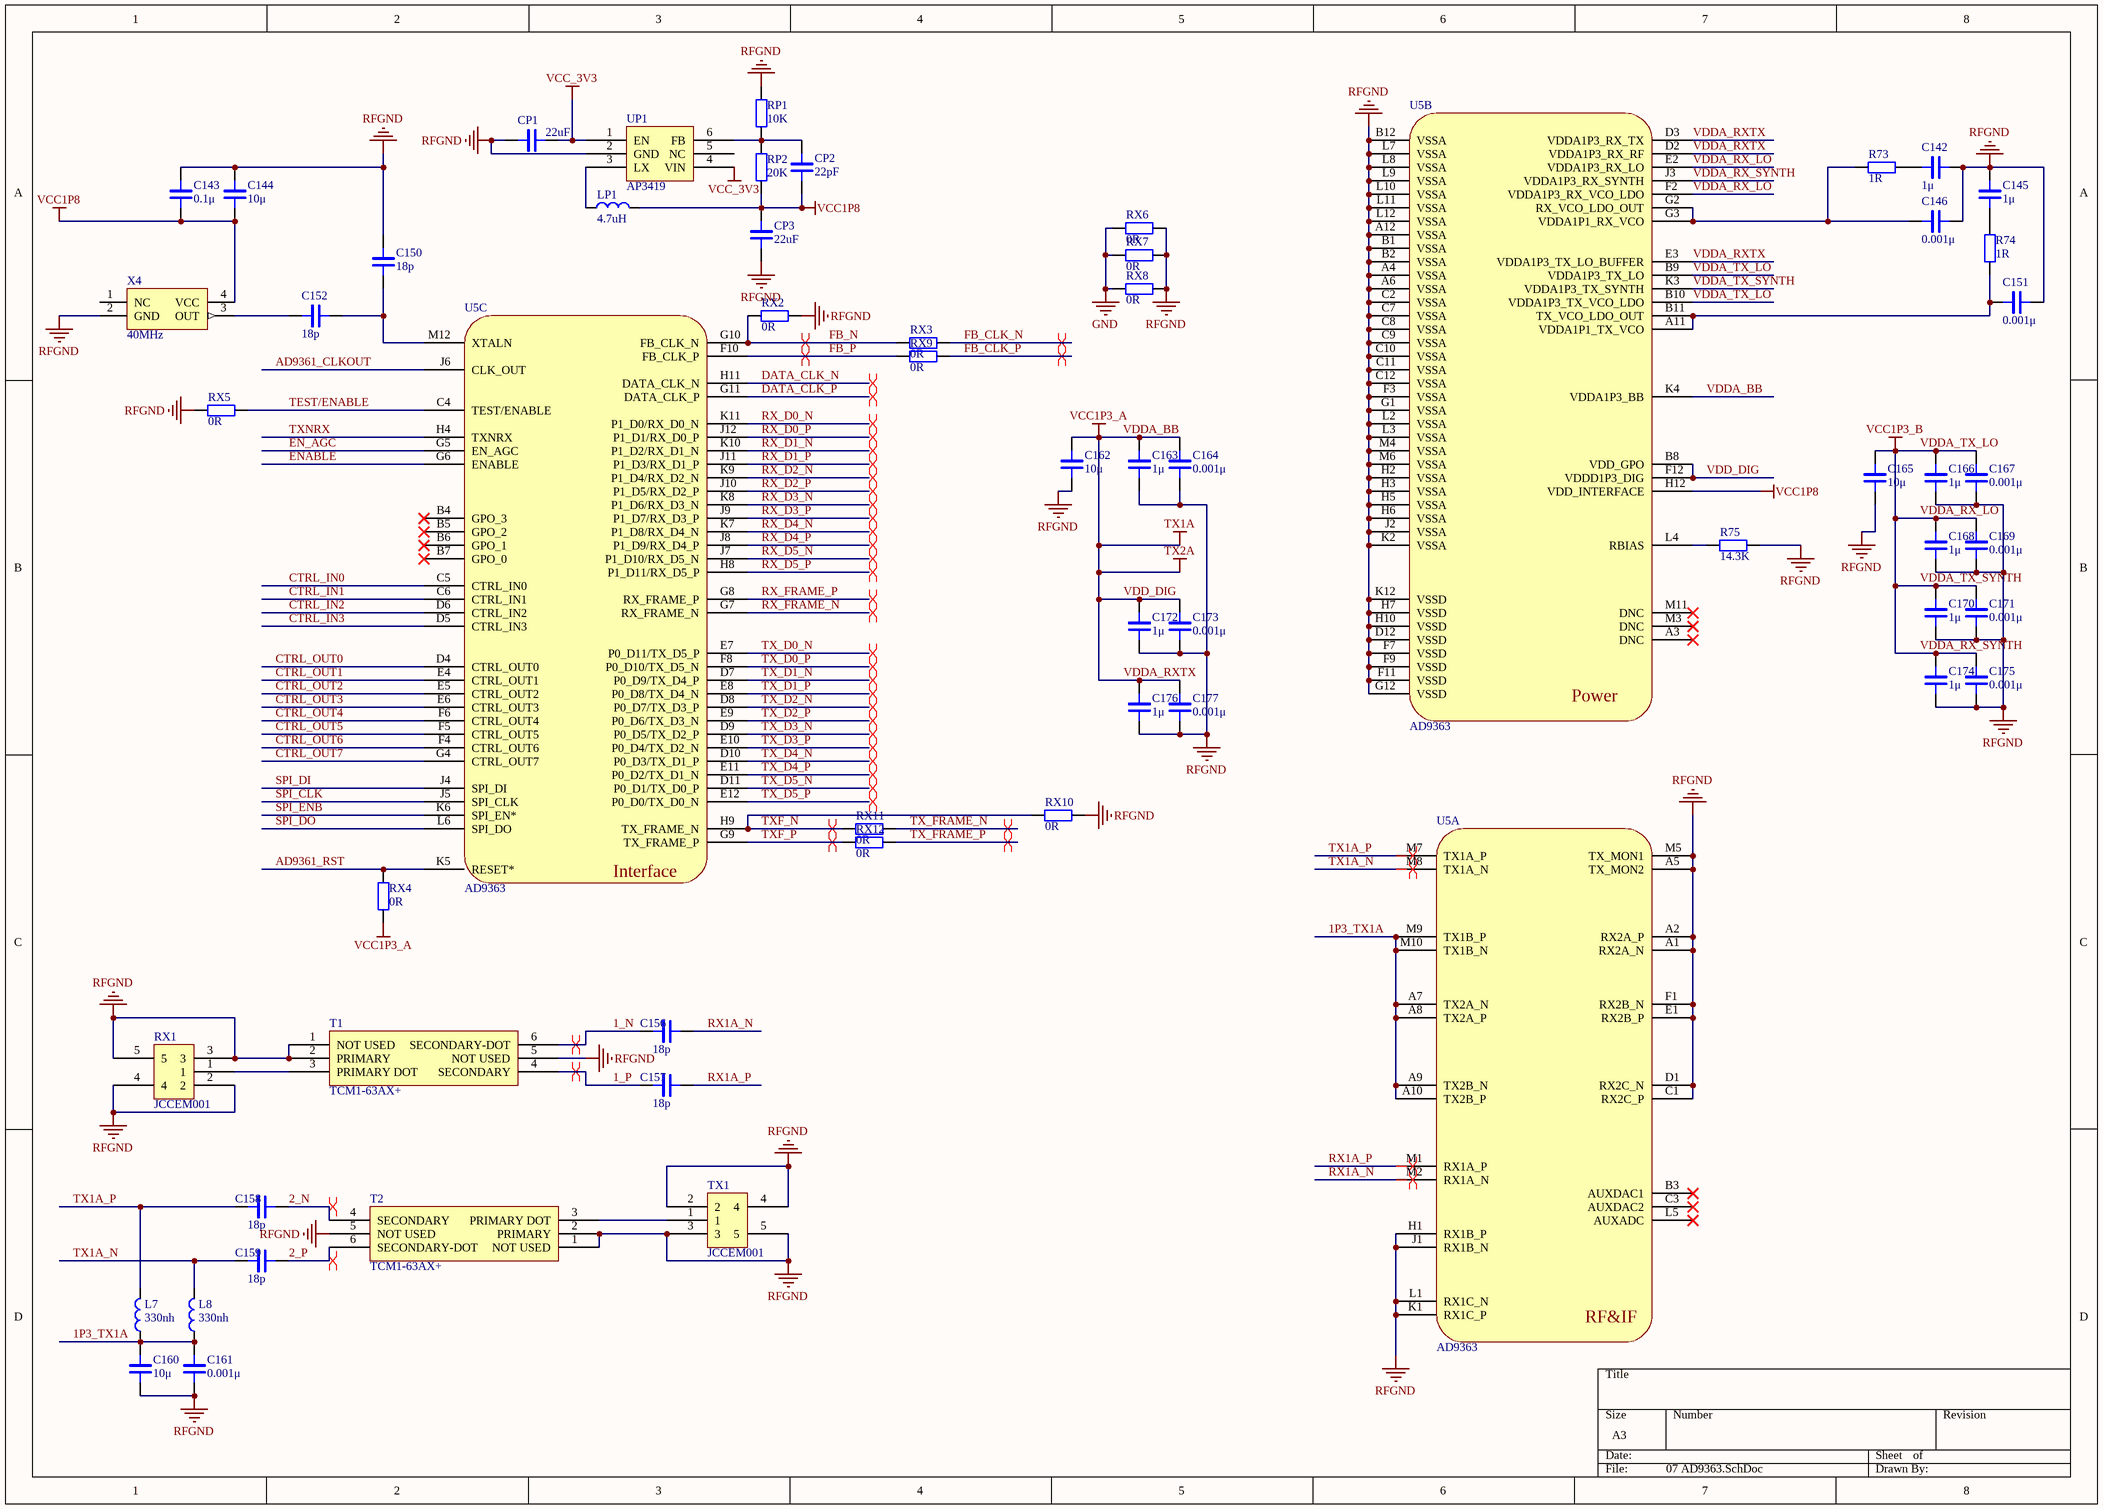
[diagram p6: 07 AD9363.SchDoc]

### Parts
C142  1μ  [LC-0402_C]
C143  0.1μ  [LC-0402_C]
C144  10μ  [LC-0402_C]
C145  1μ  [LC-0402_C]
C146  0.001μ  [LC-0402_C]
C150  18p  [LC-0402_C]
C151  0.001μ  [LC-0402_C]
C152  18p  [LC-0402_C]
C156  18p  [LC-0402_C]
C157  18p  [LC-0402_C]
C158  18p  [LC-0402_C]
C159  18p  [LC-0402_C]
C160  10μ  [LC-0402_C]
C161  0.001μ  [LC-0402_C]
C162  10μ  [LC-0402_C]
C163  1μ  [LC-0402_C]
C164  0.001μ  [LC-0402_C]
C165  10μ  [LC-0402_C]
C166  1μ  [LC-0402_C]
C167  0.001μ  [LC-0402_C]
C168  1μ  [LC-0402_C]
C169  0.001μ  [LC-0402_C]
C170  1μ  [LC-0402_C]
C171  0.001μ  [LC-0402_C]
C172  1μ  [LC-0402_C]
C173  0.001μ  [LC-0402_C]
C174  1μ  [LC-0402_C]
C175  0.001μ  [LC-0402_C]
C176  1μ  [LC-0402_C]
C177  0.001μ  [LC-0402_C]
CP1  22uF  [LC-0805_C]
CP2  22pF  [LC-0402_C]
CP3  22uF  [LC-0805_C]
L7  330nh  [LC-0603_L]
L8  330nh  [LC-0603_L]
LP1  4.7uH  [L1008]
R73  1R  [LC-0402_R]
R74  1R  [LC-0402_R]
R75  14.3K  [LC-0402_R]
RP1  10K  [LC-0402_R]
RP2  20K  [LC-0402_R]
RX1  JCCEM001  [CNSMARAL687W375H171]
RX2  0R  [LC-0402_R]
RX3  0R  [LC-0402_R]
RX4  0R  [LC-0402_R]
RX5  0R  [LC-0402_R]
RX6  0R  [LC-0603_L]
RX7  0R  [LC-0603_L]
RX8  0R  [LC-0603_L]
RX9  0R  [LC-0402_R]
RX10  0R  [LC-0402_R]
RX11  0R  [LC-0402_R]
RX12  0R  [LC-0402_R]
T1  TCM1-63AX+  [TSML150W160H160]
T2  TCM1-63AX+  [TSML150W160H160]
TX1  JCCEM001  [CNSMARAL687W375H171]
U5  AD9363  [AD936X]  (parts A,B,C of 3)
UP1  AP3419  [AP3419]
X4  40MHz  [OSC-SMD_4P-L3.2-W2.5-BL]

### Nets
GND: RX6.2 RX7.2 RX8.2
RFGND: C142.2 C143.1 C144.1 C145.1 C146.1 C150.1 C151.1 C160.2 C161.1 C162.2 C163.2 C164.2 C165.2 C166.2 C167.2 C168.2 C169.2 C170.2 C171.2 C172.2 C173.2 C174.2 C175.2 C176.2 C177.2 CP1.1 CP3.1 R75.2 RP1.2 RX1.2 RX1.3 RX1.4 RX1.5 RX2.1 RX5.1 RX6.1 RX7.1 RX8.1 RX10.1 T1.1(NOT_USED) T1.2(PRIMARY) T1.5(NOT_USED) T2.1(NOT_USED) T2.2(PRIMARY) T2.5(NOT_USED) TX1.2 TX1.3 TX1.4 TX1.5 U5.A1(RX2A_N) U5.A2(RX2A_P) U5.A4(VSSA) U5.A5(TX_MON2) U5.A6(VSSA) U5.A12(VSSA) U5.B1(VSSA) U5.B2(VSSA) U5.B12(VSSA) U5.C1(RX2C_P) U5.C2(VSSA) U5.C7(VSSA) U5.C8(VSSA) U5.C9(VSSA) U5.C10(VSSA) U5.C11(VSSA) U5.C12(VSSA) U5.D1(RX2C_N) U5.D12(VSSD) U5.E1(RX2B_P) U5.F1(RX2B_N) U5.F3(VSSA) U5.F7(VSSD) U5.F9(VSSD) U5.F11(VSSD) U5.G1(VSSA) U5.G12(VSSD) U5.H1(RX1B_P) U5.H2(VSSA) U5.H3(VSSA) U5.H5(VSSA) U5.H6(VSSA) U5.H7(VSSD) U5.H10(VSSD) U5.J1(RX1B_N) U5.J2(VSSA) U5.K1(RX1C_P) U5.K2(VSSA) U5.K12(VSSD) U5.L1(RX1C_N) U5.L2(VSSA) U5.L3(VSSA) U5.L7(VSSA) U5.L8(VSSA) U5.L9(VSSA) U5.L10(VSSA) U5.L11(VSSA) U5.L12(VSSA) U5.M4(VSSA) U5.M5(TX_MON1) U5.M6(VSSA) UP1.2(GND) X4.2(GND)
VCC1P8: C143.2 C144.2 CP2.1 CP3.2 LP1.2 RP2.1 U5.H12(VDD_INTERFACE) X4.4(VCC)
VCC_3V3: CP1.2 UP1.1(EN) UP1.4(VIN)
VDD_DIG: C162.1 C163.1 C164.1 C172.1 C173.1 C176.1 C177.1 RX4.2 U5.B8(VDD_GPO) U5.D2(VDDA1P3_RX_RF) U5.D3(VDDA1P3_RX_TX) U5.E3(VDDA1P3_TX_LO_BUFFER) U5.F12(VDDD1P3_DIG) U5.K4(VDDA1P3_BB)  [also labelled TX1A, TX2A, VCC1P3_A, VDDA_BB, VDDA_RXTX]
VDDA_RX_LO: C165.1 C166.1 C167.1 C168.1 C169.1 C170.1 C171.1 C174.1 C175.1 U5.B9(VDDA1P3_TX_LO) U5.B10(VDDA1P3_TX_VCO_LDO) U5.E2(VDDA1P3_RX_LO) U5.F2(VDDA1P3_RX_VCO_LDO) U5.J3(VDDA1P3_RX_SYNTH) U5.K3(VDDA1P3_TX_SYNTH)  [also labelled VCC1P3_B, VDDA_RX_SYNTH, VDDA_TX_LO, VDDA_TX_SYNTH]
1_N: C156.1 T1.6(SECONDARY-DOT)
1_P: C157.1 T1.4(SECONDARY)
1P3_TX1A: C160.1 C161.2 L7.1 L8.1 U5.A7(TX2A_N) U5.A8(TX2A_P) U5.A9(TX2B_N) U5.A10(TX2B_P) U5.M9(TX1B_P) U5.M10(TX1B_N)
2_N: C158.2 T2.4(SECONDARY)
2_P: C159.2 T2.6(SECONDARY-DOT)
AD9361_CLKOUT: U5.J6(CLK_OUT)
AD9361_RST: RX4.1 U5.K5(RESET*)
CTRL_IN0: U5.C5(CTRL_IN0)
CTRL_IN1: U5.C6(CTRL_IN1)
CTRL_IN2: U5.D6(CTRL_IN2)
CTRL_IN3: U5.D5(CTRL_IN3)
CTRL_OUT0: U5.D4(CTRL_OUT0)
CTRL_OUT1: U5.E4(CTRL_OUT1)
CTRL_OUT2: U5.E5(CTRL_OUT2)
CTRL_OUT3: U5.E6(CTRL_OUT3)
CTRL_OUT4: U5.F6(CTRL_OUT4)
CTRL_OUT5: U5.F5(CTRL_OUT5)
CTRL_OUT6: U5.F4(CTRL_OUT6)
CTRL_OUT7: U5.G4(CTRL_OUT7)
DATA_CLK_N: U5.H11(DATA_CLK_N)
DATA_CLK_P: U5.G11(DATA_CLK_P)
EN_AGC: U5.G5(EN_AGC)
ENABLE: U5.G6(ENABLE)
FB_CLK_N: RX3.1
FB_CLK_P: RX9.1
FB_N: RX2.2 RX3.2 U5.G10(FB_CLK_N)
FB_P: RX9.2 U5.F10(FB_CLK_P)
RX1A_N: C156.2 U5.M2(RX1A_N)
RX1A_P: C157.2 U5.M1(RX1A_P)
RX_D0_N: U5.K11(P1_D0/RX_D0_N)
RX_D0_P: U5.J12(P1_D1/RX_D0_P)
RX_D1_N: U5.K10(P1_D2/RX_D1_N)
RX_D1_P: U5.J11(P1_D3/RX_D1_P)
RX_D2_N: U5.K9(P1_D4/RX_D2_N)
RX_D2_P: U5.J10(P1_D5/RX_D2_P)
RX_D3_N: U5.K8(P1_D6/RX_D3_N)
RX_D3_P: U5.J9(P1_D7/RX_D3_P)
RX_D4_N: U5.K7(P1_D8/RX_D4_N)
RX_D4_P: U5.J8(P1_D9/RX_D4_P)
RX_D5_N: U5.J7(P1_D10/RX_D5_N)
RX_D5_P: U5.H8(P1_D11/RX_D5_P)
RX_FRAME_N: U5.G7(RX_FRAME_N)
RX_FRAME_P: U5.G8(RX_FRAME_P)
SPI_CLK: U5.J5(SPI_CLK)
SPI_DI: U5.J4(SPI_DI)
SPI_DO: U5.L6(SPI_DO)
SPI_ENB: U5.K6(SPI_EN*)
TEST/ENABLE: RX5.2 U5.C4(TEST/ENABLE)
TX1A_N: C159.1 L8.2 U5.M8(TX1A_N)
TX1A_P: C158.1 L7.2 U5.M7(TX1A_P)
TX_D0_N: U5.E7(P0_D11/TX_D5_P)
TX_D0_P: U5.F8(P0_D10/TX_D5_N)
TX_D1_N: U5.D7(P0_D9/TX_D4_P)
TX_D1_P: U5.E8(P0_D8/TX_D4_N)
TX_D2_N: U5.D8(P0_D7/TX_D3_P)
TX_D2_P: U5.E9(P0_D6/TX_D3_N)
TX_D3_N: U5.D9(P0_D5/TX_D2_P)
TX_D3_P: U5.E10(P0_D4/TX_D2_N)
TX_D4_N: U5.D10(P0_D3/TX_D1_P)
TX_D4_P: U5.E11(P0_D2/TX_D1_N)
TX_D5_N: U5.D11(P0_D1/TX_D0_P)
TX_D5_P: U5.E12(P0_D0/TX_D0_N)
TX_FRAME_N: RX11.1
TX_FRAME_P: RX12.1
TXF_N: RX10.2 RX11.2 U5.H9(TX_FRAME_N)
TXF_P: RX12.2 U5.G9(TX_FRAME_P)
TXNRX: U5.H4(TXNRX)
NetC142_1: C142.1 R73.2
NetC145_2: C145.2 R74.1
NetC146_2: C146.2 R73.1 U5.G2(RX_VCO_LDO_OUT) U5.G3(VDDA1P1_RX_VCO)
NetC150_2: C150.2 C152.1 U5.M12(XTALN)
NetC151_2: C151.2 R74.2 U5.A11(VDDA1P1_TX_VCO) U5.B11(TX_VCO_LDO_OUT)
NetC152_2: C152.2 X4.3(OUT)
NetCP2_2: CP2.2 RP1.1 RP2.2 UP1.6(FB)
NetLP1_1: LP1.1 UP1.3(LX)
NetR75_1: R75.1 U5.L4(RBIAS)
NetRX1_1: RX1.1 T1.3(PRIMARY_DOT)
NetT2_3: T2.3(PRIMARY_DOT) TX1.1

Not connected (* = marked no-connect by the designer): U5 A3(DNC)* B3(AUXDAC1)* B4(GPO_3)* B5(GPO_2)* B6(GPO_1)* B7(GPO_0)* C3(AUXDAC2)* L5(AUXADC)* M3(DNC)* M11(DNC)*; UP1 5(NC); X4 1(NC)

### Layout directives
differential pair: 1_N, 1_P, 2_N, 2_P, DATA_CLK_N, DATA_CLK_P, FB_CLK_N, FB_CLK_P, FB_N, FB_P, RX1A_N, RX1A_P, RX_D0_N, RX_D0_P, RX_D1_N, RX_D1_P, RX_D2_N, RX_D2_P, RX_D3_N, RX_D3_P, RX_D4_N, RX_D4_P, RX_D5_N, RX_D5_P, RX_FRAME_N, RX_FRAME_P, TX1A_N, TX1A_P, TX_D0_N, TX_D0_P, TX_D1_N, TX_D1_P, TX_D2_N, TX_D2_P, TX_D3_N, TX_D3_P, TX_D4_N, TX_D4_P, TX_D5_N, TX_D5_P, TX_FRAME_N, TX_FRAME_P, TXF_N, TXF_P

### Notes on the sheet
- (in symbol AD9363, part A) RF&IF
- (in symbol AD9363, part B) Power
- (in symbol AD9363, part C) Interface

### Library data of the parts
C142-C144 C160 C161 CP2 = CAP_2: Capacitor
C145 C146 C150-C152 C156-C159 C162-C177 CP1 CP3 = CAP_1: Capacitor
L7 L8 LP1 = INDUCTANCE
R73-R75 RP1 RP2 RX2-RX12 = RES_1: Resistor
X4 = XTAL-4: Oscillator

## Nets that join several sheets
GND: 01 ZYNQ_DDR (26 pins), 02 ZYNQ_PS-BANK500-501 (40 pins), 04 ZYNQ_BANK0 (46 pins), 05 POWER-SUPPLY (40 pins), 06 ZYNQ_POWER (124 pins), 07 AD9363 (RX6.2 RX7.2 RX8.2)
RFGND: 05 POWER-SUPPLY (16 pins), 07 AD9363 (102 pins)
VCC_1V0: 05 POWER-SUPPLY (5 pins), 06 ZYNQ_POWER (33 pins)
VCC_1V5: 01 ZYNQ_DDR (20 pins), 05 POWER-SUPPLY (5 pins), 06 ZYNQ_POWER (24 pins)
VCC_1V8: 02 ZYNQ_PS-BANK500-501 (18 pins), 04 ZYNQ_BANK0 (C141.1 R71.2 USD1.5), 05 POWER-SUPPLY (5 pins), 06 ZYNQ_POWER (59 pins)
VCC_3V3: 02 ZYNQ_PS-BANK500-501 (22 pins), 04 ZYNQ_BANK0 (20 pins), 05 POWER-SUPPLY (15 pins), 06 ZYNQ_POWER (14 pins), 07 AD9363 (CP1.2 UP1.1 UP1.4)
VCC_IN: 04 ZYNQ_BANK0 (C140.2 P2.13 P2.14 TU1.5), 05 POWER-SUPPLY (17 pins)
VDD_DIG: 05 POWER-SUPPLY (6 pins), 07 AD9363 (14 pins)
VDDA_RX_LO: 05 POWER-SUPPLY (6 pins), 07 AD9363 (15 pins)
AD9361_CLKOUT: 03 ZYNQ_PL-BANK34-35 (U1.H17), 07 AD9363 (U5.J6)
AD9361_RST: 03 ZYNQ_PL-BANK34-35 (U1.H16), 07 AD9363 (RX4.1 U5.K5)
CTRL_IN0: 03 ZYNQ_PL-BANK34-35 (U1.Y16), 07 AD9363 (U5.C5)
CTRL_IN1: 03 ZYNQ_PL-BANK34-35 (U1.Y17), 07 AD9363 (U5.C6)
CTRL_IN2: 03 ZYNQ_PL-BANK34-35 (U1.Y18), 07 AD9363 (U5.D6)
CTRL_IN3: 03 ZYNQ_PL-BANK34-35 (U1.V16), 07 AD9363 (U5.D5)
CTRL_OUT0: 03 ZYNQ_PL-BANK34-35 (U1.W13), 07 AD9363 (U5.D4)
CTRL_OUT1: 03 ZYNQ_PL-BANK34-35 (U1.Y14), 07 AD9363 (U5.E4)
CTRL_OUT2: 03 ZYNQ_PL-BANK34-35 (U1.W14), 07 AD9363 (U5.E5)
CTRL_OUT3: 03 ZYNQ_PL-BANK34-35 (U1.W16), 07 AD9363 (U5.E6)
CTRL_OUT4: 03 ZYNQ_PL-BANK34-35 (U1.Y19), 07 AD9363 (U5.F6)
CTRL_OUT5: 03 ZYNQ_PL-BANK34-35 (U1.V13), 07 AD9363 (U5.F5)
CTRL_OUT6: 03 ZYNQ_PL-BANK34-35 (U1.U14), 07 AD9363 (U5.F4)
CTRL_OUT7: 03 ZYNQ_PL-BANK34-35 (U1.J16), 07 AD9363 (U5.G4)
DATA_CLK_N: 03 ZYNQ_PL-BANK34-35 (U1.H20), 07 AD9363 (U5.H11)
DATA_CLK_P: 03 ZYNQ_PL-BANK34-35 (U1.J20), 07 AD9363 (U5.G11)
EN_AGC: 03 ZYNQ_PL-BANK34-35 (U1.K16), 07 AD9363 (U5.G5)
ENABLE: 03 ZYNQ_PL-BANK34-35 (U1.E17), 07 AD9363 (U5.G6)
FB_CLK_N: 03 ZYNQ_PL-BANK34-35 (U1.J19), 07 AD9363 (RX3.1)
FB_CLK_P: 03 ZYNQ_PL-BANK34-35 (U1.K19), 07 AD9363 (RX9.1)
PS_MIO7: 02 ZYNQ_PS-BANK500-501 (U1.D8), 04 ZYNQ_BANK0 (R56.2)
PS_MIO8: 02 ZYNQ_PS-BANK500-501 (U1.D5), 04 ZYNQ_BANK0 (R47.2)
QSPI_CS: 02 ZYNQ_PS-BANK500-501 (U1.A7), 04 ZYNQ_BANK0 (*.1 R59.1 U14.1)
QSPI_D0: 02 ZYNQ_PS-BANK500-501 (U1.B8), 04 ZYNQ_BANK0 (*.5 R49.2 U14.5)
QSPI_D1: 02 ZYNQ_PS-BANK500-501 (U1.D6), 04 ZYNQ_BANK0 (*.2 R51.2 U14.2)
QSPI_D2: 02 ZYNQ_PS-BANK500-501 (U1.B7), 04 ZYNQ_BANK0 (*.3 R52.2 U14.3)
QSPI_D3: 02 ZYNQ_PS-BANK500-501 (U1.A6), 04 ZYNQ_BANK0 (*.7 R50.2 U14.7)
QSPI_SCK: 02 ZYNQ_PS-BANK500-501 (U1.A5), 04 ZYNQ_BANK0 (R53.2 R58.2)
RX_D0_N: 03 ZYNQ_PL-BANK34-35 (U1.G20), 07 AD9363 (U5.K11)
RX_D0_P: 03 ZYNQ_PL-BANK34-35 (U1.G19), 07 AD9363 (U5.J12)
RX_D1_N: 03 ZYNQ_PL-BANK34-35 (U1.F20), 07 AD9363 (U5.K10)
RX_D1_P: 03 ZYNQ_PL-BANK34-35 (U1.F19), 07 AD9363 (U5.J11)
RX_D2_N: 03 ZYNQ_PL-BANK34-35 (U1.E19), 07 AD9363 (U5.K9)
RX_D2_P: 03 ZYNQ_PL-BANK34-35 (U1.E18), 07 AD9363 (U5.J10)
RX_D3_N: 03 ZYNQ_PL-BANK34-35 (U1.D20), 07 AD9363 (U5.K8)
RX_D3_P: 03 ZYNQ_PL-BANK34-35 (U1.D19), 07 AD9363 (U5.J9)
RX_D4_N: 03 ZYNQ_PL-BANK34-35 (U1.B20), 07 AD9363 (U5.K7)
RX_D4_P: 03 ZYNQ_PL-BANK34-35 (U1.C20), 07 AD9363 (U5.J8)
RX_D5_N: 03 ZYNQ_PL-BANK34-35 (U1.A20), 07 AD9363 (U5.J7)
RX_D5_P: 03 ZYNQ_PL-BANK34-35 (U1.B19), 07 AD9363 (U5.H8)
RX_FRAME_N: 03 ZYNQ_PL-BANK34-35 (U1.K18), 07 AD9363 (U5.G7)
RX_FRAME_P: 03 ZYNQ_PL-BANK34-35 (U1.K17), 07 AD9363 (U5.G8)
SD_CD: 02 ZYNQ_PS-BANK500-501 (U1.B14), 04 ZYNQ_BANK0 (R70.2 R71.1)
SD_CLK: 02 ZYNQ_PS-BANK500-501 (U1.D14), 04 ZYNQ_BANK0 (R72.2)
SD_CMD: 02 ZYNQ_PS-BANK500-501 (U1.C17), 04 ZYNQ_BANK0 (USD1.4)
SD_D0: 02 ZYNQ_PS-BANK500-501 (U1.E12), 04 ZYNQ_BANK0 (USD1.6)
SD_D1: 02 ZYNQ_PS-BANK500-501 (U1.A9), 04 ZYNQ_BANK0 (USD1.7)
SD_D2: 02 ZYNQ_PS-BANK500-501 (U1.F13), 04 ZYNQ_BANK0 (USD1.1)
SD_D3: 02 ZYNQ_PS-BANK500-501 (U1.B15), 04 ZYNQ_BANK0 (USD1.3)
SPI_CLK: 03 ZYNQ_PL-BANK34-35 (U1.L16), 07 AD9363 (U5.J5)
SPI_DI: 03 ZYNQ_PL-BANK34-35 (U1.L17), 07 AD9363 (U5.J4)
SPI_DO: 03 ZYNQ_PL-BANK34-35 (U1.G17), 07 AD9363 (U5.L6)
SPI_ENB: 03 ZYNQ_PL-BANK34-35 (U1.D18), 07 AD9363 (U5.K6)
TEST/ENABLE: 03 ZYNQ_PL-BANK34-35 (U1.V15), 07 AD9363 (RX5.2 U5.C4)
TX_D0_N: 03 ZYNQ_PL-BANK34-35 (U1.U19), 07 AD9363 (U5.E7)
TX_D0_P: 03 ZYNQ_PL-BANK34-35 (U1.U18), 07 AD9363 (U5.F8)
TX_D1_N: 03 ZYNQ_PL-BANK34-35 (U1.W20), 07 AD9363 (U5.D7)
TX_D1_P: 03 ZYNQ_PL-BANK34-35 (U1.V20), 07 AD9363 (U5.E8)
TX_D2_N: 03 ZYNQ_PL-BANK34-35 (U1.P20), 07 AD9363 (U5.D8)
TX_D2_P: 03 ZYNQ_PL-BANK34-35 (U1.N20), 07 AD9363 (U5.E9)
TX_D3_N: 03 ZYNQ_PL-BANK34-35 (U1.U20), 07 AD9363 (U5.D9)
TX_D3_P: 03 ZYNQ_PL-BANK34-35 (U1.T20), 07 AD9363 (U5.E10)
TX_D4_N: 03 ZYNQ_PL-BANK34-35 (U1.M20), 07 AD9363 (U5.D10)
TX_D4_P: 03 ZYNQ_PL-BANK34-35 (U1.M19), 07 AD9363 (U5.E11)
TX_D5_N: 03 ZYNQ_PL-BANK34-35 (U1.L20), 07 AD9363 (U5.D11)
TX_D5_P: 03 ZYNQ_PL-BANK34-35 (U1.L19), 07 AD9363 (U5.E12)
TX_FRAME_N: 03 ZYNQ_PL-BANK34-35 (U1.H18), 07 AD9363 (RX11.1)
TX_FRAME_P: 03 ZYNQ_PL-BANK34-35 (U1.J18), 07 AD9363 (RX12.1)
TXNRX: 03 ZYNQ_PL-BANK34-35 (U1.F17), 07 AD9363 (U5.H4)
UART_RX: 02 ZYNQ_PS-BANK500-501 (U1.C12), 04 ZYNQ_BANK0 (P2.11)
UART_TX: 02 ZYNQ_PS-BANK500-501 (U1.B12), 04 ZYNQ_BANK0 (P2.12)
USB_ID: 02 ZYNQ_PS-BANK500-501 (U4.23), 04 ZYNQ_BANK0 (J2.4)
USB_OTG_N: 02 ZYNQ_PS-BANK500-501 (U4.19), 04 ZYNQ_BANK0 (J2.2 P2.16)
USB_OTG_P: 02 ZYNQ_PS-BANK500-501 (U4.18), 04 ZYNQ_BANK0 (J2.3 P2.17)
USB_VBUS: 02 ZYNQ_PS-BANK500-501 (U4.22), 04 ZYNQ_BANK0 (R66.2)
USR_LED: 02 ZYNQ_PS-BANK500-501 (U1.C8), 04 ZYNQ_BANK0 (Q2.1 R65.1)
VUSB_V_EN: 02 ZYNQ_PS-BANK500-501 (U4.17), 04 ZYNQ_BANK0 (R69.1 TU1.4)